# Altium project UniversalConverter.PrjPcb (part 1 of 2)
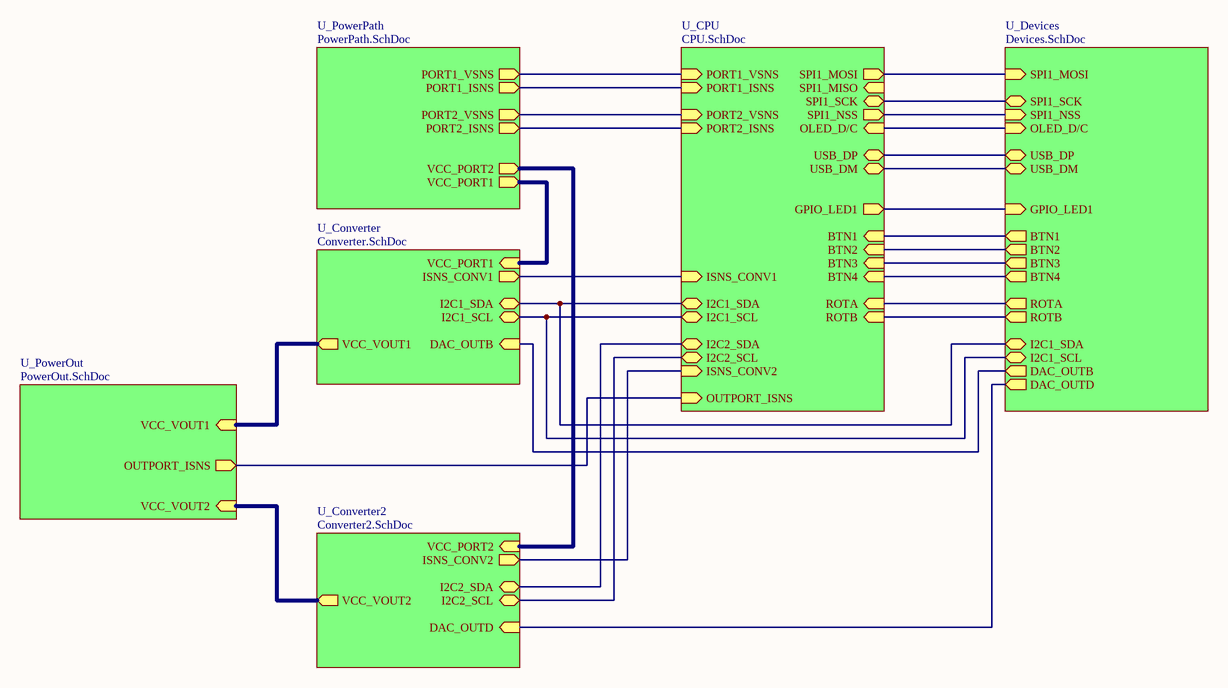
[diagram p0: TopLevel.SchDoc]
7 sheets, 242 parts. Net scope: hierarchical (ports join the sheet entries above them; power ports are global).
Board file: Board.PcbDoc
Sheets:
  TopLevel.SchDoc
    U_Converter = Converter.SchDoc
    U_Devices = Devices.SchDoc
    U_PowerPath = PowerPath.SchDoc
    U_CPU = CPU.SchDoc
    U_PowerOut = PowerOut.SchDoc
    U_Converter2 = Converter2.SchDoc

## Sheet TopLevel.SchDoc
size Tabloid

### Sub-sheets
U_Converter = Converter.SchDoc: DAC_OUTB (in), I2C1_SDA (bidir), I2C1_SCL (bidir), ISNS_CONV1 (out), VCC_PORT1 (in), VCC_VOUT1 (out)
U_Converter2 = Converter2.SchDoc: DAC_OUTD (in), I2C2_SDA (bidir), I2C2_SCL (bidir), ISNS_CONV2 (out), VCC_PORT2 (in), VCC_VOUT2 (out)
U_CPU = CPU.SchDoc: PORT1_ISNS (in), PORT1_VSNS (in), ISNS_CONV1 (in), SPI1_NSS (out), SPI1_SCK (bidir), SPI1_MISO (in), SPI1_MOSI (out), PORT2_ISNS (in), I2C2_SDA (bidir), I2C2_SCL (bidir), BTN1 (in), BTN2 (in), BTN3 (in), BTN4 (in), GPIO_LED1 (out), USB_DM (bidir), USB_DP (bidir), I2C1_SDA (bidir), I2C1_SCL (bidir), PORT2_VSNS (in), ISNS_CONV2 (in), ROTA (in), ROTB (in), OUTPORT_ISNS (in), OLED_D/C (in)
U_Devices = Devices.SchDoc: DAC_OUTB (out), DAC_OUTD (out), GPIO_LED1 (in), BTN1 (out), BTN2 (out), BTN3 (out), BTN4 (out), USB_DM (bidir), USB_DP (bidir), SPI1_NSS (in), SPI1_SCK (bidir), SPI1_MOSI (in), I2C1_SDA (bidir), I2C1_SCL (bidir), ROTA (out), ROTB (out), OLED_D/C (in)
U_PowerOut = PowerOut.SchDoc: VCC_VOUT1 (in), VCC_VOUT2 (in), OUTPORT_ISNS (out)
U_PowerPath = PowerPath.SchDoc: PORT1_VSNS (out), PORT2_VSNS (out), PORT2_ISNS (out), PORT1_ISNS (out), VCC_PORT1 (out), VCC_PORT2 (out)

### Nets
VCC_PORT1: sheet U_Converter/VCC_PORT1, sheet U_PowerPath/VCC_PORT1
VCC_PORT2: sheet U_PowerPath/VCC_PORT2, sheet U_Converter2/VCC_PORT2
VCC_VOUT1: sheet U_Converter/VCC_VOUT1, sheet U_PowerOut/VCC_VOUT1
VCC_VOUT2: sheet U_PowerOut/VCC_VOUT2, sheet U_Converter2/VCC_VOUT2
BTN1: sheet U_Devices/BTN1, sheet U_CPU/BTN1
BTN2: sheet U_Devices/BTN2, sheet U_CPU/BTN2
BTN3: sheet U_Devices/BTN3, sheet U_CPU/BTN3
BTN4: sheet U_Devices/BTN4, sheet U_CPU/BTN4
DAC_OUTB: sheet U_Converter/DAC_OUTB, sheet U_Devices/DAC_OUTB
DAC_OUTD: sheet U_Devices/DAC_OUTD, sheet U_Converter2/DAC_OUTD
GPIO_LED1: sheet U_Devices/GPIO_LED1, sheet U_CPU/GPIO_LED1
I2C1_SCL: sheet U_Converter/I2C1_SCL, sheet U_Devices/I2C1_SCL, sheet U_CPU/I2C1_SCL
I2C1_SDA: sheet U_Converter/I2C1_SDA, sheet U_Devices/I2C1_SDA, sheet U_CPU/I2C1_SDA
I2C2_SCL: sheet U_CPU/I2C2_SCL, sheet U_Converter2/I2C2_SCL
I2C2_SDA: sheet U_CPU/I2C2_SDA, sheet U_Converter2/I2C2_SDA
ISNS_CONV1: sheet U_Converter/ISNS_CONV1, sheet U_CPU/ISNS_CONV1
ISNS_CONV2: sheet U_CPU/ISNS_CONV2, sheet U_Converter2/ISNS_CONV2
OUTPORT_ISNS: sheet U_CPU/OUTPORT_ISNS, sheet U_PowerOut/OUTPORT_ISNS
PORT1_ISNS: sheet U_PowerPath/PORT1_ISNS, sheet U_CPU/PORT1_ISNS
PORT1_VSNS: sheet U_PowerPath/PORT1_VSNS, sheet U_CPU/PORT1_VSNS
PORT2_ISNS: sheet U_PowerPath/PORT2_ISNS, sheet U_CPU/PORT2_ISNS
PORT2_VSNS: sheet U_PowerPath/PORT2_VSNS, sheet U_CPU/PORT2_VSNS
SPI1_MOSI: sheet U_Devices/SPI1_MOSI, sheet U_CPU/SPI1_MOSI
SPI1_NSS: sheet U_Devices/SPI1_NSS, sheet U_CPU/SPI1_NSS
SPI1_SCK: sheet U_Devices/SPI1_SCK, sheet U_CPU/SPI1_SCK
USB_DM: sheet U_Devices/USB_DM, sheet U_CPU/USB_DM
USB_DP: sheet U_Devices/USB_DP, sheet U_CPU/USB_DP
NetR40_1: sheet U_Devices/ROTA, sheet U_CPU/ROTA
NetR43_1: sheet U_Devices/ROTB, sheet U_CPU/ROTB
NetU9_41: sheet U_Devices/OLED_D/C, sheet U_CPU/OLED_D/C

## Sheet Converter.SchDoc
size Tabloid
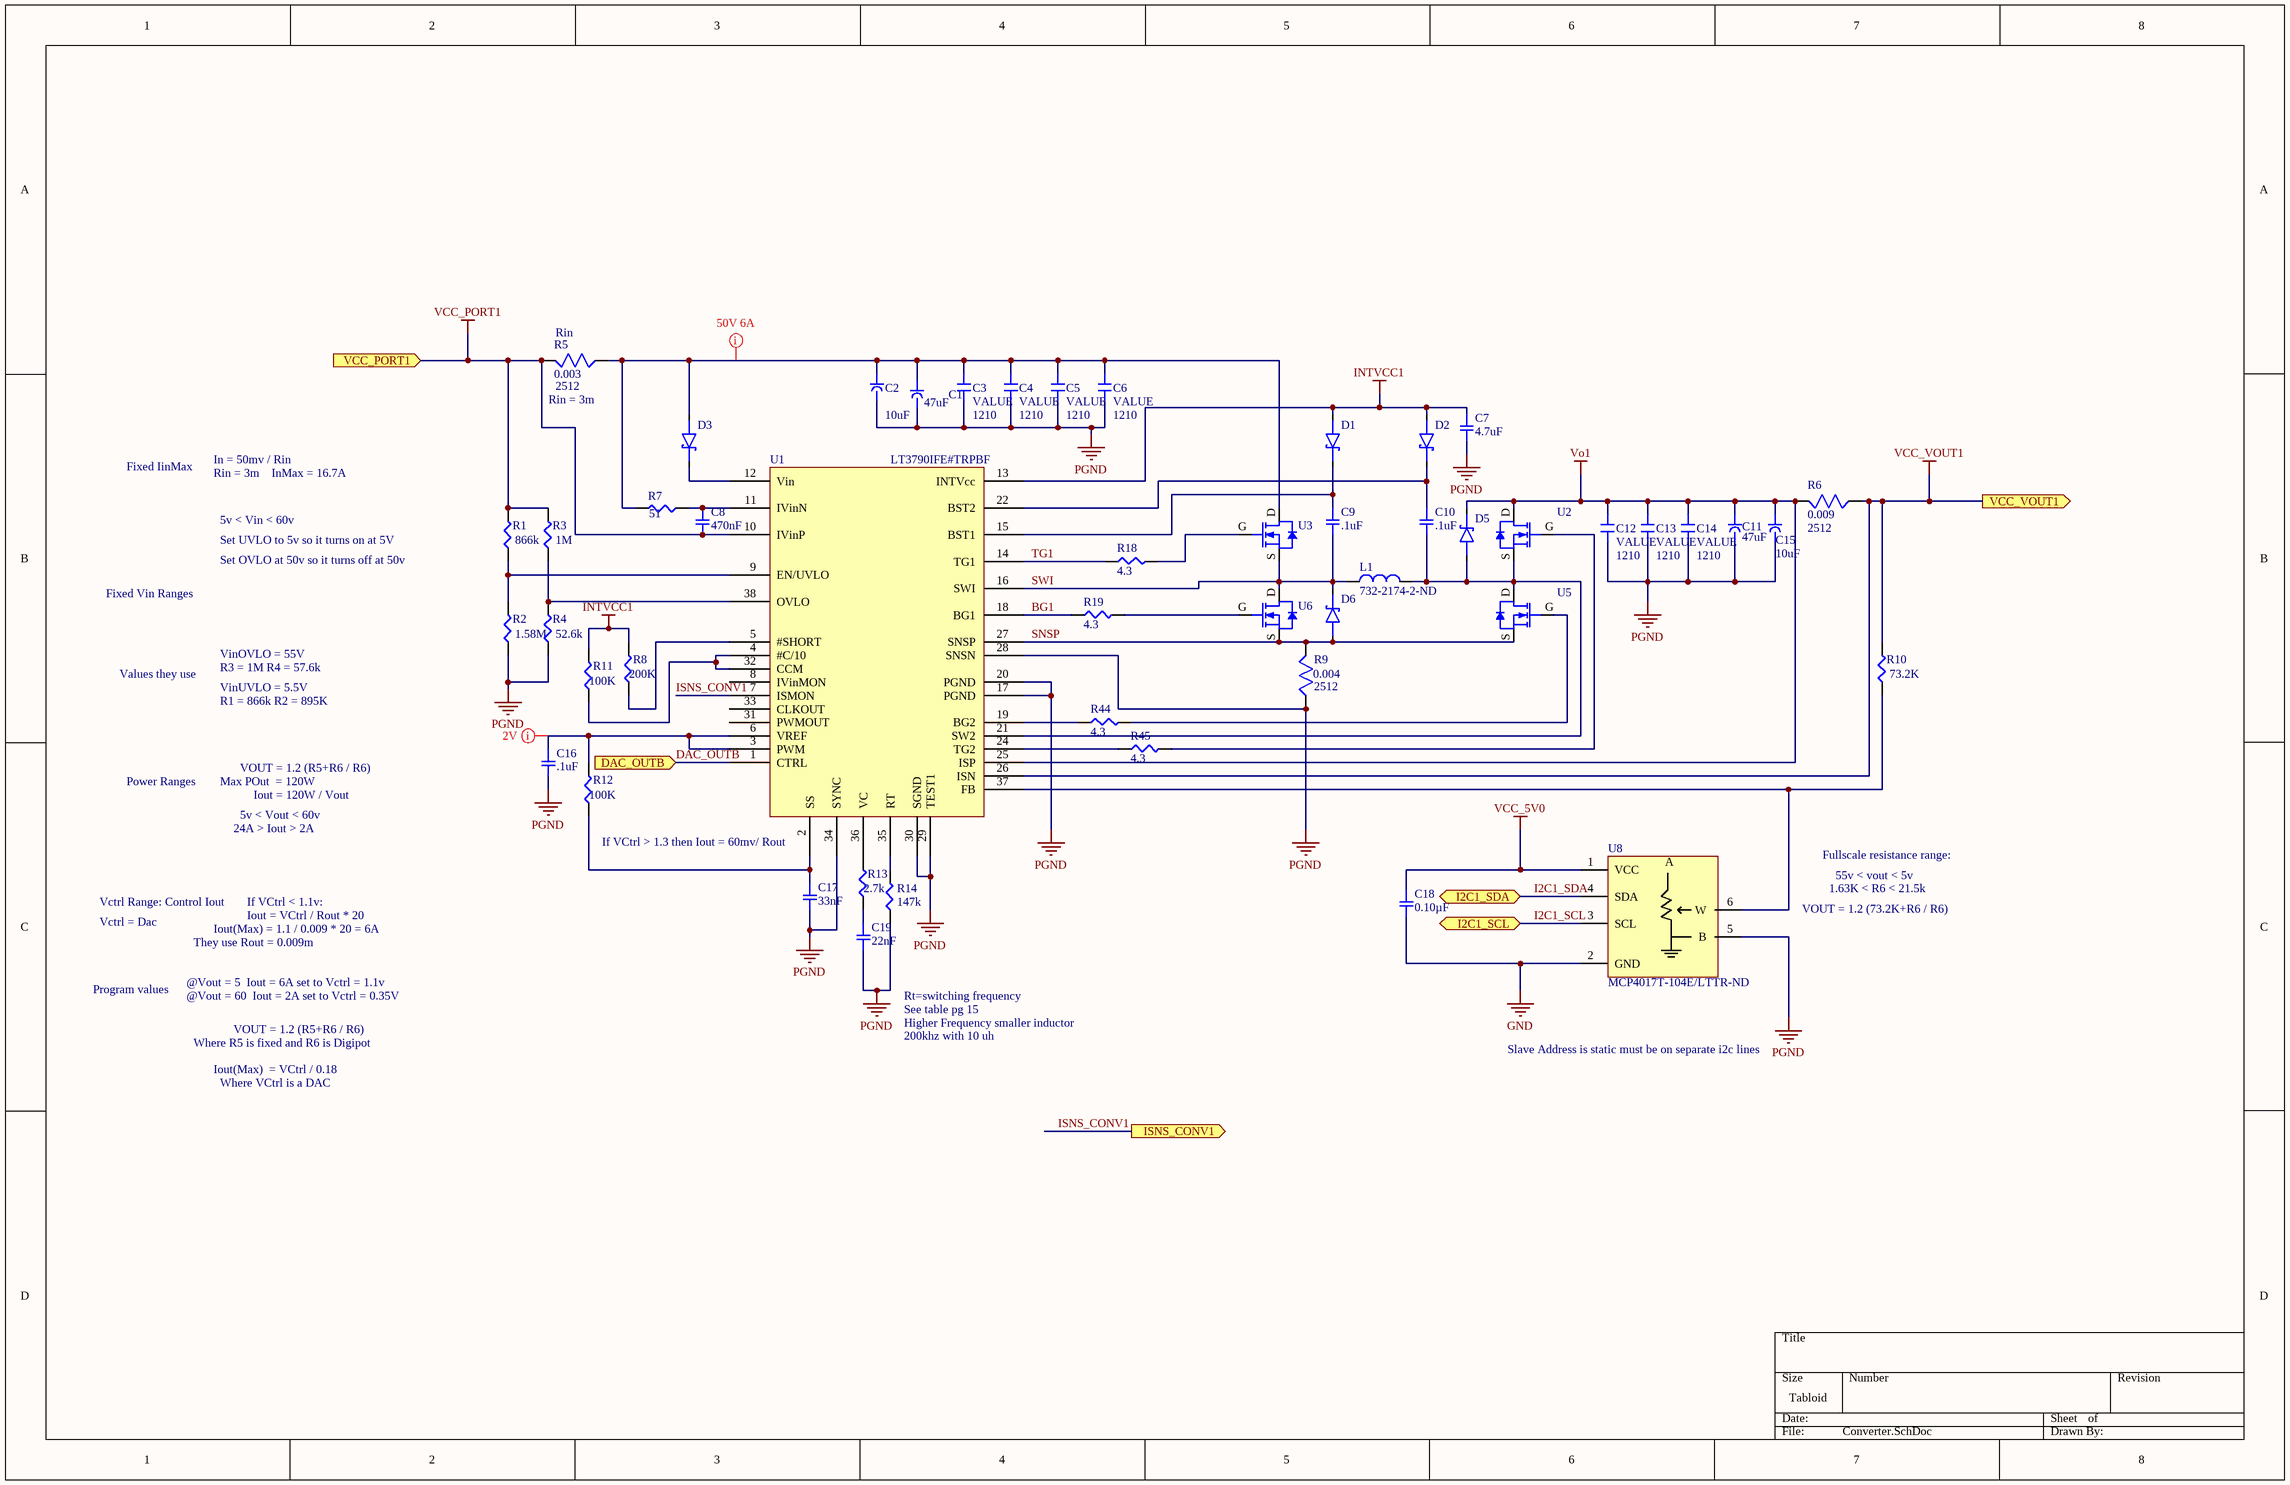
[diagram p1: Converter.SchDoc]

### Parts
C1  10-EEE-FN1K470UVTR-ND  [EEE-FN1K470UV]  (value not drawn)
C2  value 10uF  [panasonic d8]  (hidden comment: EEE-FN1K100XL)
C3  VALUE  Size: 1210  [1210 cap]
C4  VALUE  Size: 1210  [1210 cap]
C5  VALUE  Size: 1210  [1210 cap]
C6  VALUE  Size: 1210  [1210 cap]
C7  4.7uF  [SMD-0603C]
C8  470nF  [SMD-0603C]
C9  .1uF  [SMD-0603C]
C10  .1uF  [SMD-0603C]
C11  10-EEE-FN1K470UVTR-ND  [EEE-FN1K470UV]  (value not drawn)
C12  VALUE  Size: 1210  [1210 cap]
C13  VALUE  Size: 1210  [1210 cap]
C14  VALUE  Size: 1210  [1210 cap]
C15  value 10uF  [panasonic d8]  (hidden comment: EEE-FN1K100XL)
C16  .1uF  [SMD-0603C]
C17  33nF  [SMD-0603C]
C18  0.10µF  [SMD-0603C]
C19  22nF  [SMD-0603C]
D1  BAT46WJ,115  [SOD323F]  (value not drawn)
D2  BAT46WJ,115  [SOD323F]  (value not drawn)
D3  SK58L-TPMSTR-ND  [SMC(DO-214AB)]  (value not drawn)
D5  SK58L-TPMSTR-ND  [SMC(DO-214AB)]  (value not drawn)
D6  SK58L-TPMSTR-ND  [SMC(DO-214AB)]  (value not drawn)
L1  732-2174-2-ND  [Inductor]
R1  866k  [SMD-0603-RES]
R2  1.58M  [SMD-0603-RES]
R3  1M  [SMD-0603-RES]
R4  52.6k  [SMD-0603-RES]
R5  0.003  [2512]
R6  0.009  [2512]
R7  51  [SMD-0603-RES]
R8  200K  [SMD-0603-RES]
R9  0.004  [2512]
R10  73.2K  [SMD-0603-RES]
R11  100K  [SMD-0603-RES]
R12  100K  [SMD-0603-RES]
R13  2.7k  [SMD-0603-RES]
R14  147k  [SMD-0603-RES]
R18  4.3  [SMD-0603-RES]
R19  4.3  [SMD-0603-RES]
R44  4.3  [SMD-0603-RES]
R45  4.3  [SMD-0603-RES]
U1  LT3790IFE#TRPBF  [TSSOP-38-GNDPAD]
U2  SQJA80EP-T1_GE3TR-ND  [PowerPAK® SO-8L SINGLE]  (value not drawn)
U3  SQJA80EP-T1_GE3TR-ND  [PowerPAK® SO-8L SINGLE]  (value not drawn)
U5  SQJA80EP-T1_GE3TR-ND  [PowerPAK® SO-8L SINGLE]  (value not drawn)
U6  SQJA80EP-T1_GE3TR-ND  [PowerPAK® SO-8L SINGLE]  (value not drawn)
U8  MCP4017T-104E/LTTR-ND  [SC70]

### Ports
DAC_OUTB (in), I2C1_SCL (bidir), I2C1_SDA (bidir), ISNS_CONV1 (out), VCC_PORT1 (in), VCC_VOUT1 (out)

### Nets
GND: C18.2 U8.2(GND)
INTVCC1: C7.1 D1.2 D2.2 R8.2 R11.2 U1.13(INTVcc)
PGND: C1.1 C2.2 C3.2 C4.2 C5.2 C6.2 C7.2 C11.1 C12.2 C13.2 C14.2 C15.2 C16.2 C17.2 C19.2 R2.1 R4.1 R9.1 R14.1 U1.17(PGND) U1.20(PGND) U1.28(SNSN) U1.29(TEST1) U1.30(SGND) U1.34(SYNC) U8.5(B)
VCC_5V0: C18.1 U8.1(VCC)
VCC_PORT1: C8.2 R1.2 R3.2 R5.2 U1.10(IVinP) ; port VCC_PORT1
VCC_VOUT1: R6.1 R10.2 U1.26(ISN) ; port VCC_VOUT1
Vo1: C11.2 C12.1 C13.1 C14.1 C15.1 D5.1 R6.2 U1.25(ISP) U2.D(DRAIN)
BG1: R19.1 U1.18(BG1)
DAC_OUTB: U1.1(CTRL) ; port DAC_OUTB
I2C1_SCL: U8.3(SCL) ; port I2C1_SCL
I2C1_SDA: U8.4(SDA) ; port I2C1_SDA
ISNS_CONV1: U1.7(ISMON) ; port ISNS_CONV1
SNSP: D6.2 R9.2 U1.27(SNSP) U5.S(SOURCE) U6.S(SOURCE)
SWI: C9.2 D6.1 L1.1 U1.16(SWI) U3.S(SOURCE) U6.D(DRAIN)
TG1: R18.1 U1.14(TG1)
NetC1_2: C1.2 C2.1 C3.1 C4.1 C5.1 C6.1 D3.2 R5.1 R7.2 U3.D(DRAIN)
NetC8_1: C8.1 R7.1 U1.11(IVinN)
NetC9_1: C9.1 D1.1 U1.15(BST1)
NetC10_1: C10.1 D2.1 U1.22(BST2)
NetC10_2: C10.2 D5.2 L1.2 U1.21(SW2) U2.S(SOURCE) U5.D(DRAIN)
NetC16_1: C16.1 R12.2 U1.3(PWM) U1.6(VREF)
NetC17_1: C17.1 R12.1 U1.2(SS)
NetC19_1: C19.1 R13.1
NetD3_1: D3.1 U1.12(Vin)
NetR1_1: R1.1 R2.2 U1.9(EN/UVLO)
NetR3_1: R3.1 R4.2 U1.38(OVLO)
NetR8_1: R8.1 U1.5(#SHORT)
NetR10_1: R10.1 U1.37(FB) U8.6(W)
NetR11_1: R11.1 U1.4(#C/10) U1.32(CCM)
NetR13_2: R13.2 U1.36(VC)
NetR14_2: R14.2 U1.35(RT)
NetR18_2: R18.2 U3.G(GATE)
NetR19_2: R19.2 U6.G(GATE)
NetR44_1: R44.1 U1.19(BG2)
NetR44_2: R44.2 U5.G(GATE)
NetR45_1: R45.1 U1.24(TG2)
NetR45_2: R45.2 U2.G(GATE)

Not connected (* = marked no-connect by the designer): U1 8(IVinMON) 31(PWMOUT) 33(CLKOUT)

### Layout directives
mark named 2V: NetC16_1
mark named 50V 6A: NetC1_2

### Notes on the sheet
- (near R5) Rin
- (near R5) Rin = 3m
- Fixed IinMax
- Rin = 3m    InMax = 16.7A
- In = 50mv / Rin
- Set UVLO to 5v so it turns on at 5V
- Set OVLO at 50v so it turns off at 50v
- 5v < Vin < 60v
- Fixed Vin Ranges
- Values they use
- VinOVLO = 55V
- R3 = 1M R4 = 57.6k
- VinUVLO = 5.5V
- R1 = 866k R2 = 895K
- Power Ranges
- Max POut  = 120W
- 24A > Iout > 2A
- 5v < Vout < 60v
- VOUT = 1.2 (R5+R6 / R6)
- Iout = 120W / Vout
- If VCtrl > 1.3 then Iout = 60mv/ Rout
- Fullscale resistance range:
- 1.63K < R6 < 21.5k
- 55v < vout < 5v
- Vctrl Range: Control Iout
- Vctrl = Dac
- They use Rout = 0.009m
- Iout(Max) = 1.1 / 0.009 * 20 = 6A
- If VCtrl < 1.1v:
- Iout = VCtrl / Rout * 20
- VOUT = 1.2 (73.2K+R6 / R6)
- Program values
- @Vout = 5  Iout = 6A set to Vctrl = 1.1v
- @Vout = 60  Iout = 2A set to Vctrl = 0.35V
- Rt=switching frequency
- See table pg 15
- Higher Frequency smaller inductor
- Where R5 is fixed and R6 is Digipot
- Iout(Max)  = VCtrl / 0.18
- Where VCtrl is a DAC
- 200khz with 10 uh
- Slave Address is static must be on separate i2c lines
- (in symbol CAP ALUM 47UF) 47uF
- (in symbol IC DIGIPOT MCP4017T-104E/LT) A

### Library data of the parts
C1 C11 = CAP ALUM 47UF: CAP ALUM 47UF 20% 80V SMD
C2 C15 = CAP ALUM 10UF: CAP ALUM 10UF 20% 80V SMD
C3-C6 C12-C14 = CAP SMD 1210
C7-C10 C16 C17 C19 = GCJ188R71H472KA01D: 0603; Manufacturer: Murata Electronics North America; Factory Stock: 0; Unit Price (USD): 0.19; Minimum Quantity: 1; Value: 4700pF; Tolerance: ±10%; Voltage: 50V; Temperature Coefficient: X7R; Datasheets: http://www.murata.com/~/media/webrenewal/support/library/catalog/products/capacitor/mlcc/c03e.ashx; Image: //media.digikey.com/Renders/Murata%20Renders/0603%28LQG18%29.jpg; Digi-Key Part Number: 490-5764-1-ND; Part Number: GCJ188R71H472KA01D; Quantity Available: 7743; @ qty: 0; Packaging: Cut Tape (CT); Series: GCJ; Part Status: Active; Operating Temperature: -55°C ~ 125°C; Features: Soft Termination; Ratings: AEC-Q200; Applications: Automotive, Boardflex Sensitive; Mounting Type: Surface Mount, MLCC; Package / Case: 0603 (1608 Metric); Size / Dimension: 0.063" L x 0.031" W (1.60mm x 0.80mm); Height - Seated (Max): -; Thickness (Max): 0.031" (0.80mm); Lead Spacing: -; Lead Style: -
C18 = GCJ188R71H104KA12D: CAP CER 0.1UF 50V X7R 0603; Manufacturer: Murata Electronics North America; Factory Stock: 0; Unit Price (USD): 0.12; Minimum Quantity: 1; Tolerance: ±10%; Datasheets: http://www.murata.com/~/media/webrenewal/support/library/catalog/products/capacitor/mlcc/c03e.ashx; Image: //media.digikey.com/Renders/Murata%20Renders/0603%28LQG18%29.jpg; Digi-Key Part Number: 490-5798-1-ND; Part Number: GCJ188R71H104KA12D; Quantity Available: 163695; @ qty: 0; Packaging: Cut Tape (CT); Series: GCJ; Part Status: Active; Value: 0.10µF; Voltage: 50V; Temperature Coefficient: X7R; Operating Temperature: -55°C ~ 125°C; Features: Soft Termination; Ratings: AEC-Q200; Applications: Automotive, Boardflex Sensitive; Mounting Type: Surface Mount, MLCC; Package / Case: 0603 (1608 Metric); Size / Dimension: 0.063" L x 0.031" W (1.60mm x 0.80mm); Height - Seated (Max): -; Thickness (Max): 0.035" (0.90mm); Lead Spacing: -; Lead Style: -
D1 D2 = BAT46WJ,115: DIODE SCHOTTKY 100V 250MA SOD323 / Diode Schottky 100 V 250mA (DC) Surface Mount SOD-323F; Mfr_Name: Nexperia; Type: DEV; Copyright: Copyright (C) 2021 Ultra Librarian. All rights reserved.; Manufacturer_Part_Number: BAT46WJ,115; Digi-Key_Part_Number_1: 1727-4817-2-ND; Digi-Key_Part_Number_2: 1727-4817-1-ND; Digi-Key_Part_Number_3: 1727-4817-6-ND; RefDes: RefDes
D3 D5 D6 = DIODE SK58L-TP: DIODE SCHOTTKY 80V 5A DO214AB/SMC / Diode Schottky 80 V 5A Surface Mount SMC (DO-214AB)
L1 = INDUCTOR 7443556680: FIXED IND 6.8UH 18.5A 4.1MOHM SM
R1-R4 R7 R8 R10-R14 = ERJ-3BQJ5R6V: 0603; Manufacturer: Panasonic Electronic Components; Factory Stock: 0; Unit Price (USD): 0.03980; @ qty: 1500; Minimum Quantity: 1; Value: 5.6; Tolerance: ±5%; Power (Watts): 0.25W, 1/4W; Temperature Coefficient: ±200ppm/°C; Part Number: ERJ-3BQJ5R6V; Datasheets: https://industrial.panasonic.com/cdbs/www-data/pdf/RDA0000/AOA0000C239.pdf; Image: //media.digikey.com/Photos/Panasonic%20Photos/MFG_ERJ-P6W%20Series.jpg; Digi-Key Part Number: P17425CT-ND; Quantity Available: 3950; Packaging: Cut Tape (CT); Series: ERJ; Part Status: Active; Composition: Thick Film; Features: Automotive AEC-Q200, Current Sense; Operating Temperature: -55°C ~ 125°C; Package / Case: 0603 (1608 Metric); Supplier Device Package: 0603; Size / Dimension: 0.063" L x 0.031" W (1.60mm x 0.80mm); Height - Seated (Max): 0.022" (0.55mm); Number of Terminations: 2; Failure Rate: -
R5 R6 R9 = RES SMD 2512: RES SMD 2512 2W; Size: 2512
R18 R19 R44 R45 = ERJ-3BQF1R0V: RES SMD 1 OHM 1% 1/4W 0603; Manufacturer: Panasonic Electronic Components; Factory Stock: 0; Unit Price (USD): 0.05386; @ qty: 1500; Minimum Quantity: 1; Value: 1; Power (Watts): 0.25W, 1/4W; Temperature Coefficient: ±200ppm/°C; Part Number: ERJ-3BQF1R0V; Datasheets: https://industrial.panasonic.com/cdbs/www-data/pdf/RDA0000/AOA0000C239.pdf; Image: //media.digikey.com/Photos/Panasonic%20Photos/MFG_ERJ-P6W%20Series.jpg; Digi-Key Part Number: P17371CT-ND; Quantity Available: 30514; Packaging: Cut Tape (CT); Series: ERJ; Part Status: Active; Tolerance: ±1%; Composition: Thick Film; Features: Automotive AEC-Q200, Current Sense; Operating Temperature: -55°C ~ 125°C; Package / Case: 0603 (1608 Metric); Supplier Device Package: 0603; Size / Dimension: 0.063" L x 0.031" W (1.60mm x 0.80mm); Height - Seated (Max): 0.022" (0.55mm); Number of Terminations: 2; Failure Rate: -
U1 = IC LT3790 BUCK/BOOST 60V 150W: IC REG CTRLR BUCK-BOOST 38TSSOP / Buck-Boost Regulator Positive Output Step-Up/Step-Down - DC-DC Controller IC 38-TSSOP-EP
U2 U3 U5 U6 = FET SQJA80EP-T1_GE3: MOSFET N-CH 80V 60A PPAK SO-8
U8 = IC DIGIPOT MCP4017T-104E/LT: IC DGT POT 100KOHM 128TAP SC70-6

## Sheet Devices.SchDoc
size Tabloid
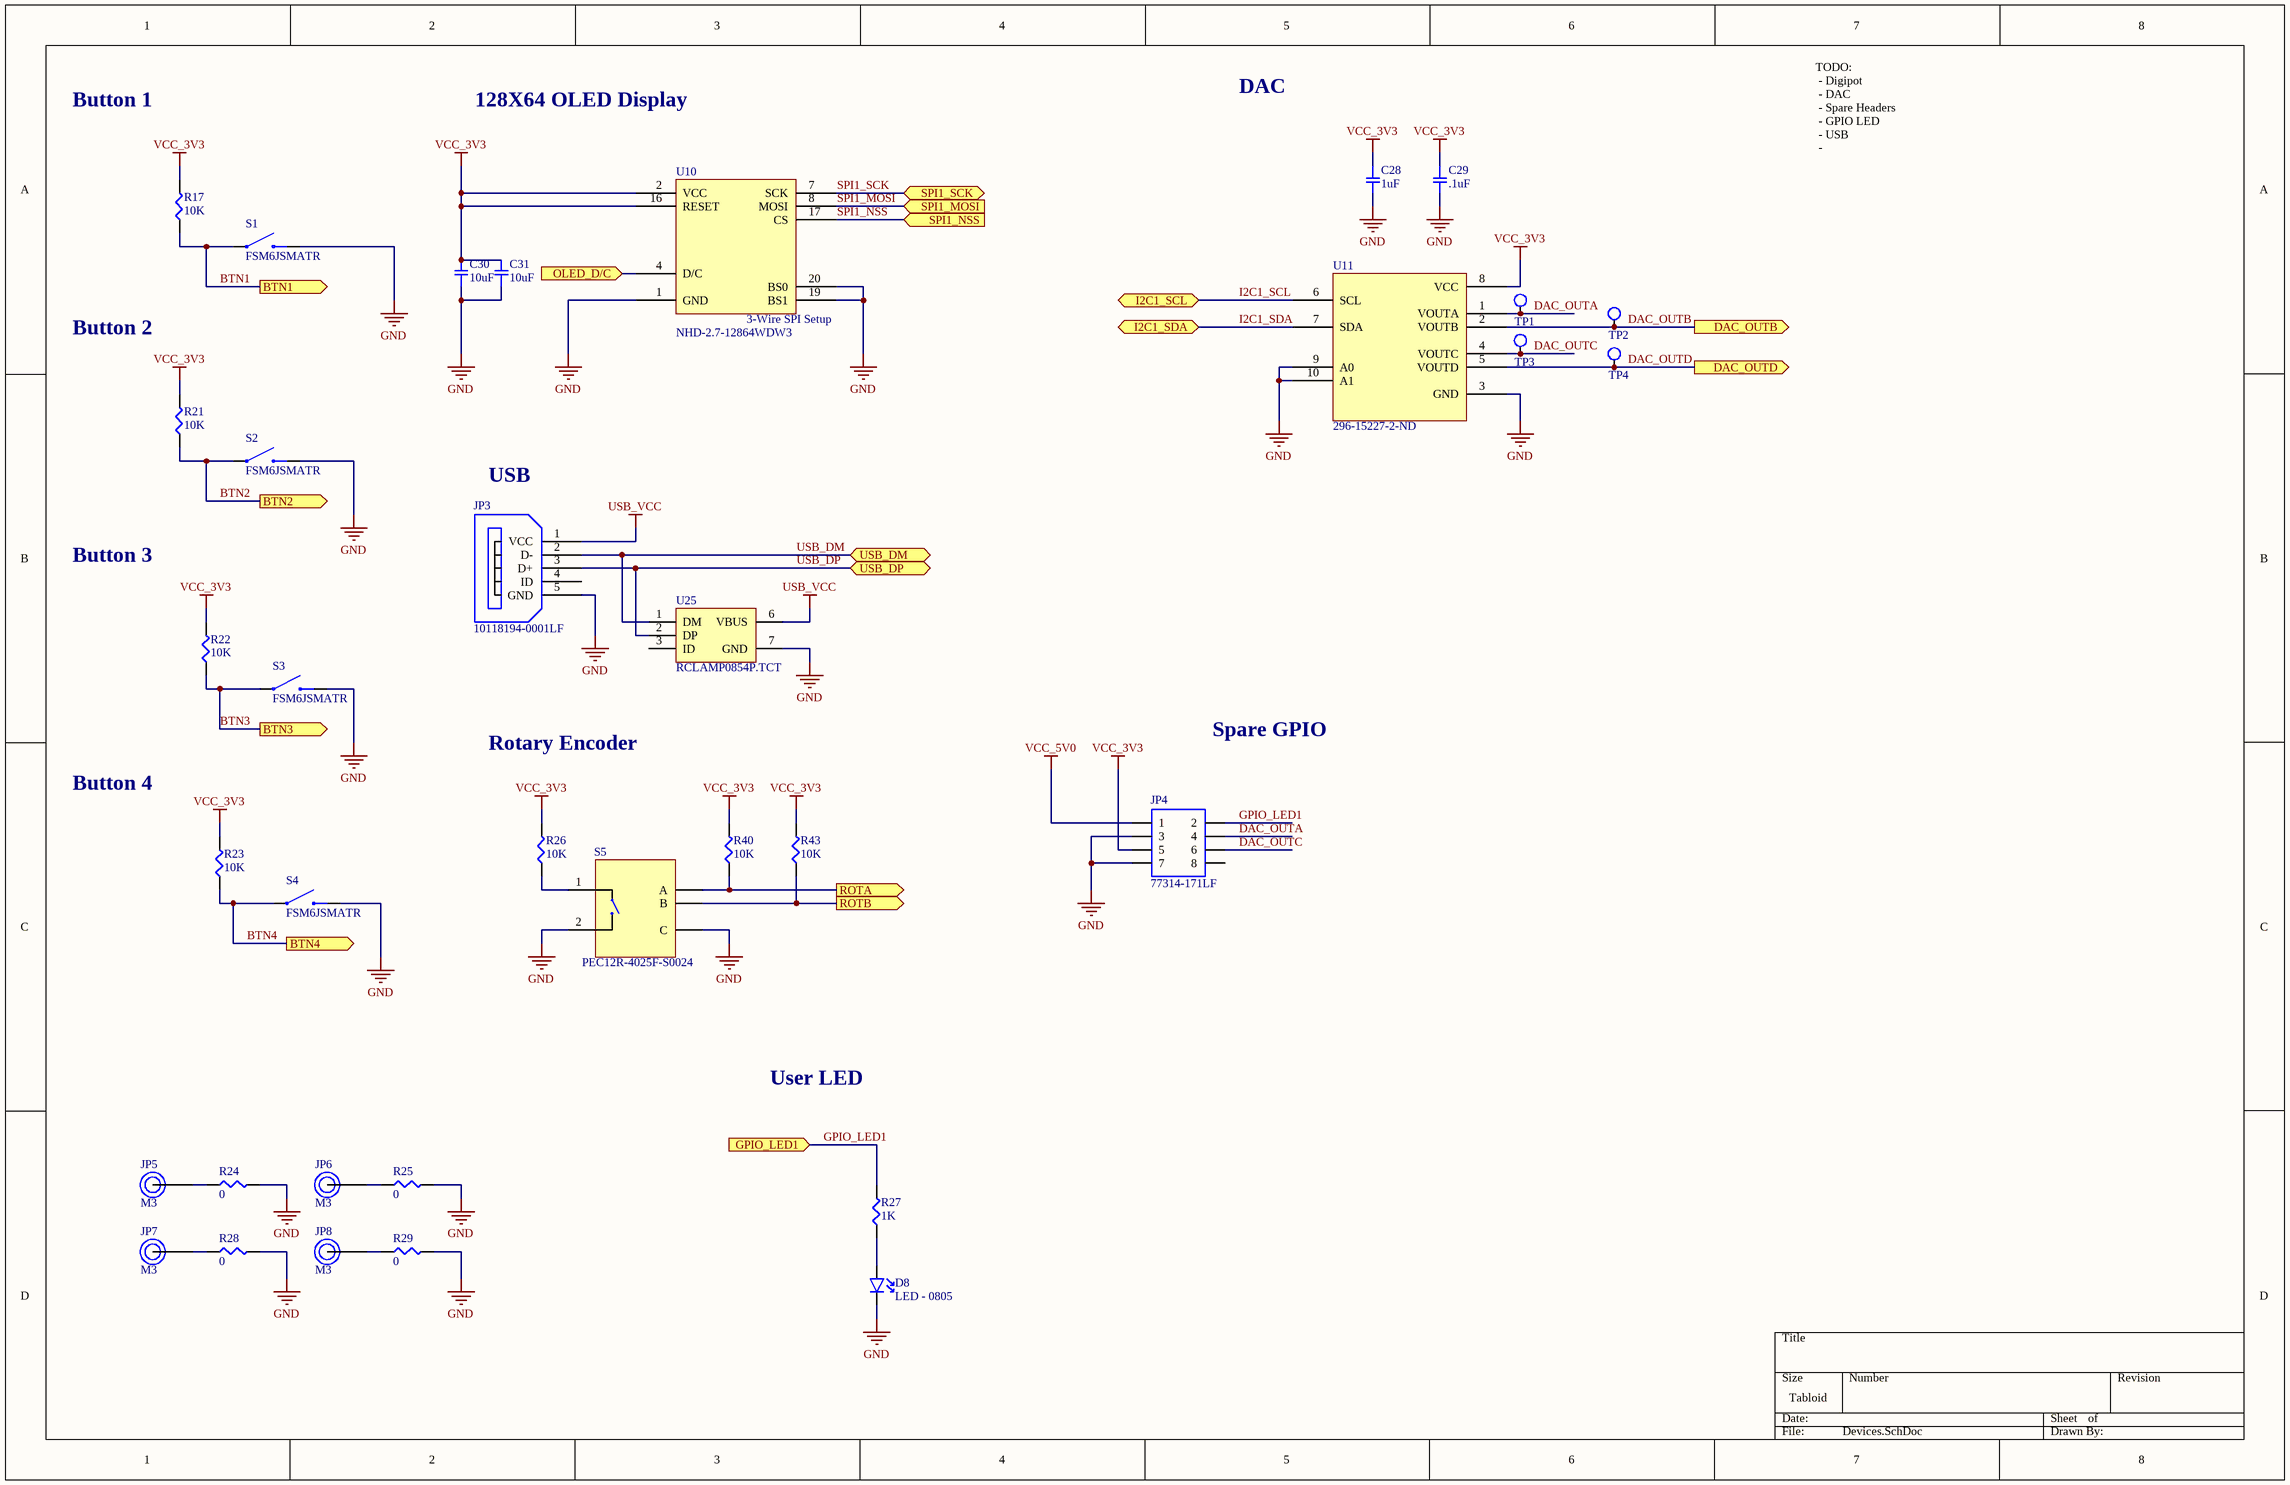
[diagram p2: Devices.SchDoc]

### Parts
C28  1uF  [SMD-0603C]
C29  .1uF  [SMD-0603C]
C30  10uF  [SMD-0805C]
C31  10uF  [SMD-0805C]
D8  LED - 0805  [0805 SMD]
JP3  10118194-0001LF  [014-439]
JP4  77314-171LF  [2x4 Pin Header]
JP5  M3  [M3-Hole]
JP6  M3  [M3-Hole]
JP7  M3  [M3-Hole]
JP8  M3  [M3-Hole]
R17  10K  [SMD-0805-RES]
R21  10K  [SMD-0805-RES]
R22  10K  [SMD-0805-RES]
R23  10K  [SMD-0805-RES]
R24  0  [SMD-0603-RES]
R25  0  [SMD-0603-RES]
R26  10K  [SMD-0805-RES]
R27  1K  [SMD-0603-RES]
R28  0  [SMD-0603-RES]
R29  0  [SMD-0603-RES]
R40  10K  [SMD-0805-RES]
R43  10K  [SMD-0805-RES]
S1  FSM6JSMATR  [TACTILE 4 PIN SMD 6MM]
S2  FSM6JSMATR  [TACTILE 4 PIN SMD 6MM]
S3  FSM6JSMATR  [TACTILE 4 PIN SMD 6MM]
S4  FSM6JSMATR  [TACTILE 4 PIN SMD 6MM]
S5  PEC12R-4025F-S0024  [PEC12R-4025F-S]
TP1  TEST POINT 1MM  [TEST POINT]  (value not drawn)
TP2  TEST POINT 1MM  [TEST POINT]  (value not drawn)
TP3  TEST POINT 1MM  [TEST POINT]  (value not drawn)
TP4  TEST POINT 1MM  [TEST POINT]  (value not drawn)
U10  NHD-2.7-12864WDW3  [NHD-2.7-12864WDW3]
U11  296-15227-2-ND  [10-VSSOP]
U25  RCLAMP0854P.TCT  [6-UFDFN]

### Ports
BTN1 (out), BTN2 (out), BTN3 (out), BTN4 (out), DAC_OUTB (out), DAC_OUTD (out), GPIO_LED1 (in), I2C1_SCL (bidir), I2C1_SDA (bidir), OLED_D/C (in), ROTA (out), ROTB (out), SPI1_MOSI (in), SPI1_NSS (in), SPI1_SCK (bidir), USB_DM (bidir), USB_DP (bidir)

### Nets
GND: C28.2 C29.2 C30.1 C31.1 D8.2 JP3.5(GND) JP4.3 JP4.7 R24.2 R25.2 R28.2 R29.2 S1.2 S2.2 S3.2 S4.2 S5.2 S5.C U10.1(GND) U10.19(BS1) U10.20(BS0) U11.3(GND) U11.9(A0) U11.10(A1) U25.7(GND)
USB_VCC: JP3.1(VCC) U25.6(VBUS)
VCC_3V3: C28.1 C29.1 C30.2 C31.2 JP4.5 R17.2 R21.2 R22.2 R23.2 R26.2 R40.2 R43.2 U10.2(VCC) U10.16(RESET) U11.8(VCC)
VCC_5V0: JP4.1
BTN1: R17.1 S1.1 ; port BTN1
BTN2: R21.1 S2.1 ; port BTN2
BTN3: R22.1 S3.1 ; port BTN3
BTN4: R23.1 S4.1 ; port BTN4
DAC_OUTA: JP4.4 TP1.1 U11.1(VOUTA)
DAC_OUTB: TP2.1 U11.2(VOUTB) ; port DAC_OUTB
DAC_OUTC: JP4.6 TP3.1 U11.4(VOUTC)
DAC_OUTD: TP4.1 U11.5(VOUTD) ; port DAC_OUTD
GPIO_LED1: JP4.2 R27.2 ; port GPIO_LED1
I2C1_SCL: U11.6(SCL) ; port I2C1_SCL
I2C1_SDA: U11.7(SDA) ; port I2C1_SDA
SPI1_MOSI: U10.8(MOSI) ; port SPI1_MOSI
SPI1_NSS: U10.17(CS) ; port SPI1_NSS
SPI1_SCK: U10.7(SCK) ; port SPI1_SCK
USB_DM: JP3.2(D-) U25.1(DM) ; port USB_DM
USB_DP: JP3.3(D+) U25.2(DP) ; port USB_DP
NetD8_1: D8.1 R27.1
NetJP5_1: JP5.1 R24.1
NetJP6_1: JP6.1 R25.1
NetJP7_1: JP7.1 R28.1
NetJP8_1: JP8.1 R29.1
NetR26_1: R26.1 S5.1
NetR40_1: R40.1 S5.A ; port ROTA
NetR43_1: R43.1 S5.B ; port ROTB
NetU9_41: U10.4(D/C) ; port OLED_D/C

Not connected (* = marked no-connect by the designer): JP3 4(ID); JP4 8; U25 3(ID)

### Notes on the sheet
- DAC
- Button 1
- 128X64 OLED Display
- TODO:
  - Digipot
  - DAC
  - Spare Headers
  - GPIO LED
  - USB
  -
- Button 2
- USB
- Button 3
- Rotary Encoder
- Spare GPIO
- Button 4
- User LED
- (in symbol DISP OLED GRAPHIC 128X64 WHT) 3-Wire SPI Setup

### Library data of the parts
C28 C29 = GCJ188R71H223KA01D: CAP CER 0.022UF 50V X7R 0603; Manufacturer: Murata Electronics North America; Factory Stock: 0; Unit Price (USD): 0.22; Minimum Quantity: 1; Value: 0.022µF; Tolerance: ±10%; Datasheets: http://www.murata.com/~/media/webrenewal/support/library/catalog/products/capacitor/mlcc/c03e.ashx; Image: //media.digikey.com/Renders/Murata%20Renders/0603%28LQG18%29.jpg; Digi-Key Part Number: 490-5851-1-ND; Part Number: GCJ188R71H223KA01D; Quantity Available: 7651; @ qty: 0; Packaging: Cut Tape (CT); Series: GCJ; Part Status: Active; Voltage: 50V; Temperature Coefficient: X7R; Operating Temperature: -55°C ~ 125°C; Features: Soft Termination; Ratings: AEC-Q200; Applications: Automotive, Boardflex Sensitive; Mounting Type: Surface Mount, MLCC; Package / Case: 0603 (1608 Metric); Size / Dimension: 0.063" L x 0.031" W (1.60mm x 0.80mm); Height - Seated (Max): -; Thickness (Max): 0.031" (0.80mm); Lead Spacing: -; Lead Style: -
C30 C31 = LLA219R71C104MA01L: CAP CER 0.1UF 16V X7R 0805; Manufacturer: Murata Electronics North America; Factory Stock: 0; Unit Price (USD): 0.36; Minimum Quantity: 1; Value: 0.10µF; Tolerance: ±20%; Datasheets: http://www.murata.com/~/media/webrenewal/support/library/catalog/products/capacitor/mlcc/c02e.pdf; Image: //media.digikey.com/Renders/Murata%20Renders/0805-LLA.jpg; Digi-Key Part Number: 490-4414-1-ND; Part Number: LLA219R71C104MA01L; Quantity Available: 7094; @ qty: 0; Packaging: Cut Tape (CT); Series: LLA; Part Status: Active; Voltage: 16V; Temperature Coefficient: X7R; Operating Temperature: -55°C ~ 125°C; Features: Low ESL (Multi-Terminal); Ratings: -; Applications: Bypass, Decoupling; Mounting Type: Surface Mount, MLCC; Package / Case: 0805 (2012 Metric); Size / Dimension: 0.079" L x 0.049" W (2.00mm x 1.25mm); Height - Seated (Max): -; Thickness (Max): 0.037" (0.95mm); Lead Spacing: -; Lead Style: -
JP3 = CONN USB: CONN RCPT USB2.0 MICRO B SMD R/A
JP4 = CONN HEADER VERT 2x4: CONN HEADER VERT 8POS 2.54MM
JP5-JP8 = HOLE MOUNT M3: M3 MOUNT HOLE SIZE
R17 R21-R23 R26 R40 R43 = ERJ-6BWFR100V: RES SMD 0.1 OHM 1% 1/2W 0805; Manufacturer: Panasonic Electronic Components; Factory Stock: 0; Unit Price (USD): 0.15268; @ qty: 1500; Minimum Quantity: 1; Value: 0.1; Power (Watts): 0.5W, 1/2W; Temperature Coefficient: ±200ppm/°C; Part Number: ERJ-6BWFR100V; Datasheets: https://industrial.panasonic.com/cdbs/www-data/pdf/RDA0000/AOA0000C239.pdf; Image: //media.digikey.com/Renders/Panasonic%20Renders/ERJ-0805%20Pkg.jpg; Digi-Key Part Number: P17589CT-ND; Quantity Available: 12233; Packaging: Cut Tape (CT); Series: ERJ; Part Status: Active; Tolerance: ±1%; Composition: Thick Film; Features: Automotive AEC-Q200, Current Sense; Operating Temperature: -55°C ~ 155°C; Package / Case: 0805 (2012 Metric); Supplier Device Package: 0805; Size / Dimension: 0.079" L x 0.049" W (2.00mm x 1.25mm); Height - Seated (Max): 0.030" (0.75mm); Number of Terminations: 2; Failure Rate: -
R24 R25 R28 R29 = ERJ-3BQFR33V: RES SMD 0.33 OHM 1% 1/4W 0603; Manufacturer: Panasonic Electronic Components; Unit Price (USD): 0.05386; @ qty: 1500; Minimum Quantity: 1; Value: 0.33; Power (Watts): 0.25W, 1/4W; Temperature Coefficient: ±300ppm/°C; Part Number: ERJ-3BQFR33V; Datasheets: https://industrial.panasonic.com/cdbs/www-data/pdf/RDA0000/AOA0000C239.pdf; Image: //media.digikey.com/Photos/Panasonic%20Photos/MFG_ERJ-P6W%20Series.jpg; Digi-Key Part Number: P17396CT-ND; Quantity Available: 1368; Factory Stock: 0; Packaging: Cut Tape (CT); Series: ERJ; Part Status: Active; Tolerance: ±1%; Composition: Thick Film; Features: Automotive AEC-Q200, Current Sense; Operating Temperature: -55°C ~ 125°C; Package / Case: 0603 (1608 Metric); Supplier Device Package: 0603; Size / Dimension: 0.063" L x 0.031" W (1.60mm x 0.80mm); Height - Seated (Max): 0.022" (0.55mm); Number of Terminations: 2; Failure Rate: -
R27 = ERJ-3BQF1R5V: RES SMD 1.5 OHM 1% 1/4W 0603; Manufacturer: Panasonic Electronic Components; Factory Stock: 0; Unit Price (USD): 0.06115; @ qty: 1500; Minimum Quantity: 1; Value: 1.5; Power (Watts): 0.25W, 1/4W; Temperature Coefficient: ±200ppm/°C; Part Number: ERJ-3BQF1R5V; Datasheets: https://industrial.panasonic.com/cdbs/www-data/pdf/RDA0000/AOA0000C239.pdf; Image: //media.digikey.com/Photos/Panasonic%20Photos/MFG_ERJ-P6W%20Series.jpg; Digi-Key Part Number: P15988CT-ND; Quantity Available: 1591; Packaging: Cut Tape (CT); Series: ERJ; Part Status: Active; Tolerance: ±1%; Composition: Thick Film; Features: Automotive AEC-Q200, Current Sense; Operating Temperature: -55°C ~ 125°C; Package / Case: 0603 (1608 Metric); Supplier Device Package: 0603; Size / Dimension: 0.063" L x 0.031" W (1.60mm x 0.80mm); Height - Seated (Max): 0.022" (0.55mm); Number of Terminations: 2; Failure Rate: -
S1-S4 = SWITCH TACTILE SPST: SWITCH TACTILE SPST-NO 0.05A 24V
S5 = RTRY ENCDR MECH 24PPR: Rotary Encoder Mechanical 24 Quadrature (Incremental) Vertical
TP1-TP4 = TEST POINT 1MM: 1mm pad for test points
U10 = DISP OLED GRAPHIC 128X64 WHT: Graphic LCD Display Module  White OLED - Passive Matrix Parallel/Serial 2.7" (68.58mm) 128 x 64
U11 = IC DAC DAC7574IDGSR: IC DAC 12BIT V-OUT 10VSSOP
U25 = IC RCLAMP0854P.TCT: TVS DIODE 5.5VWM 30VC SLP1616P6

## Sheet PowerPath.SchDoc
size Tabloid
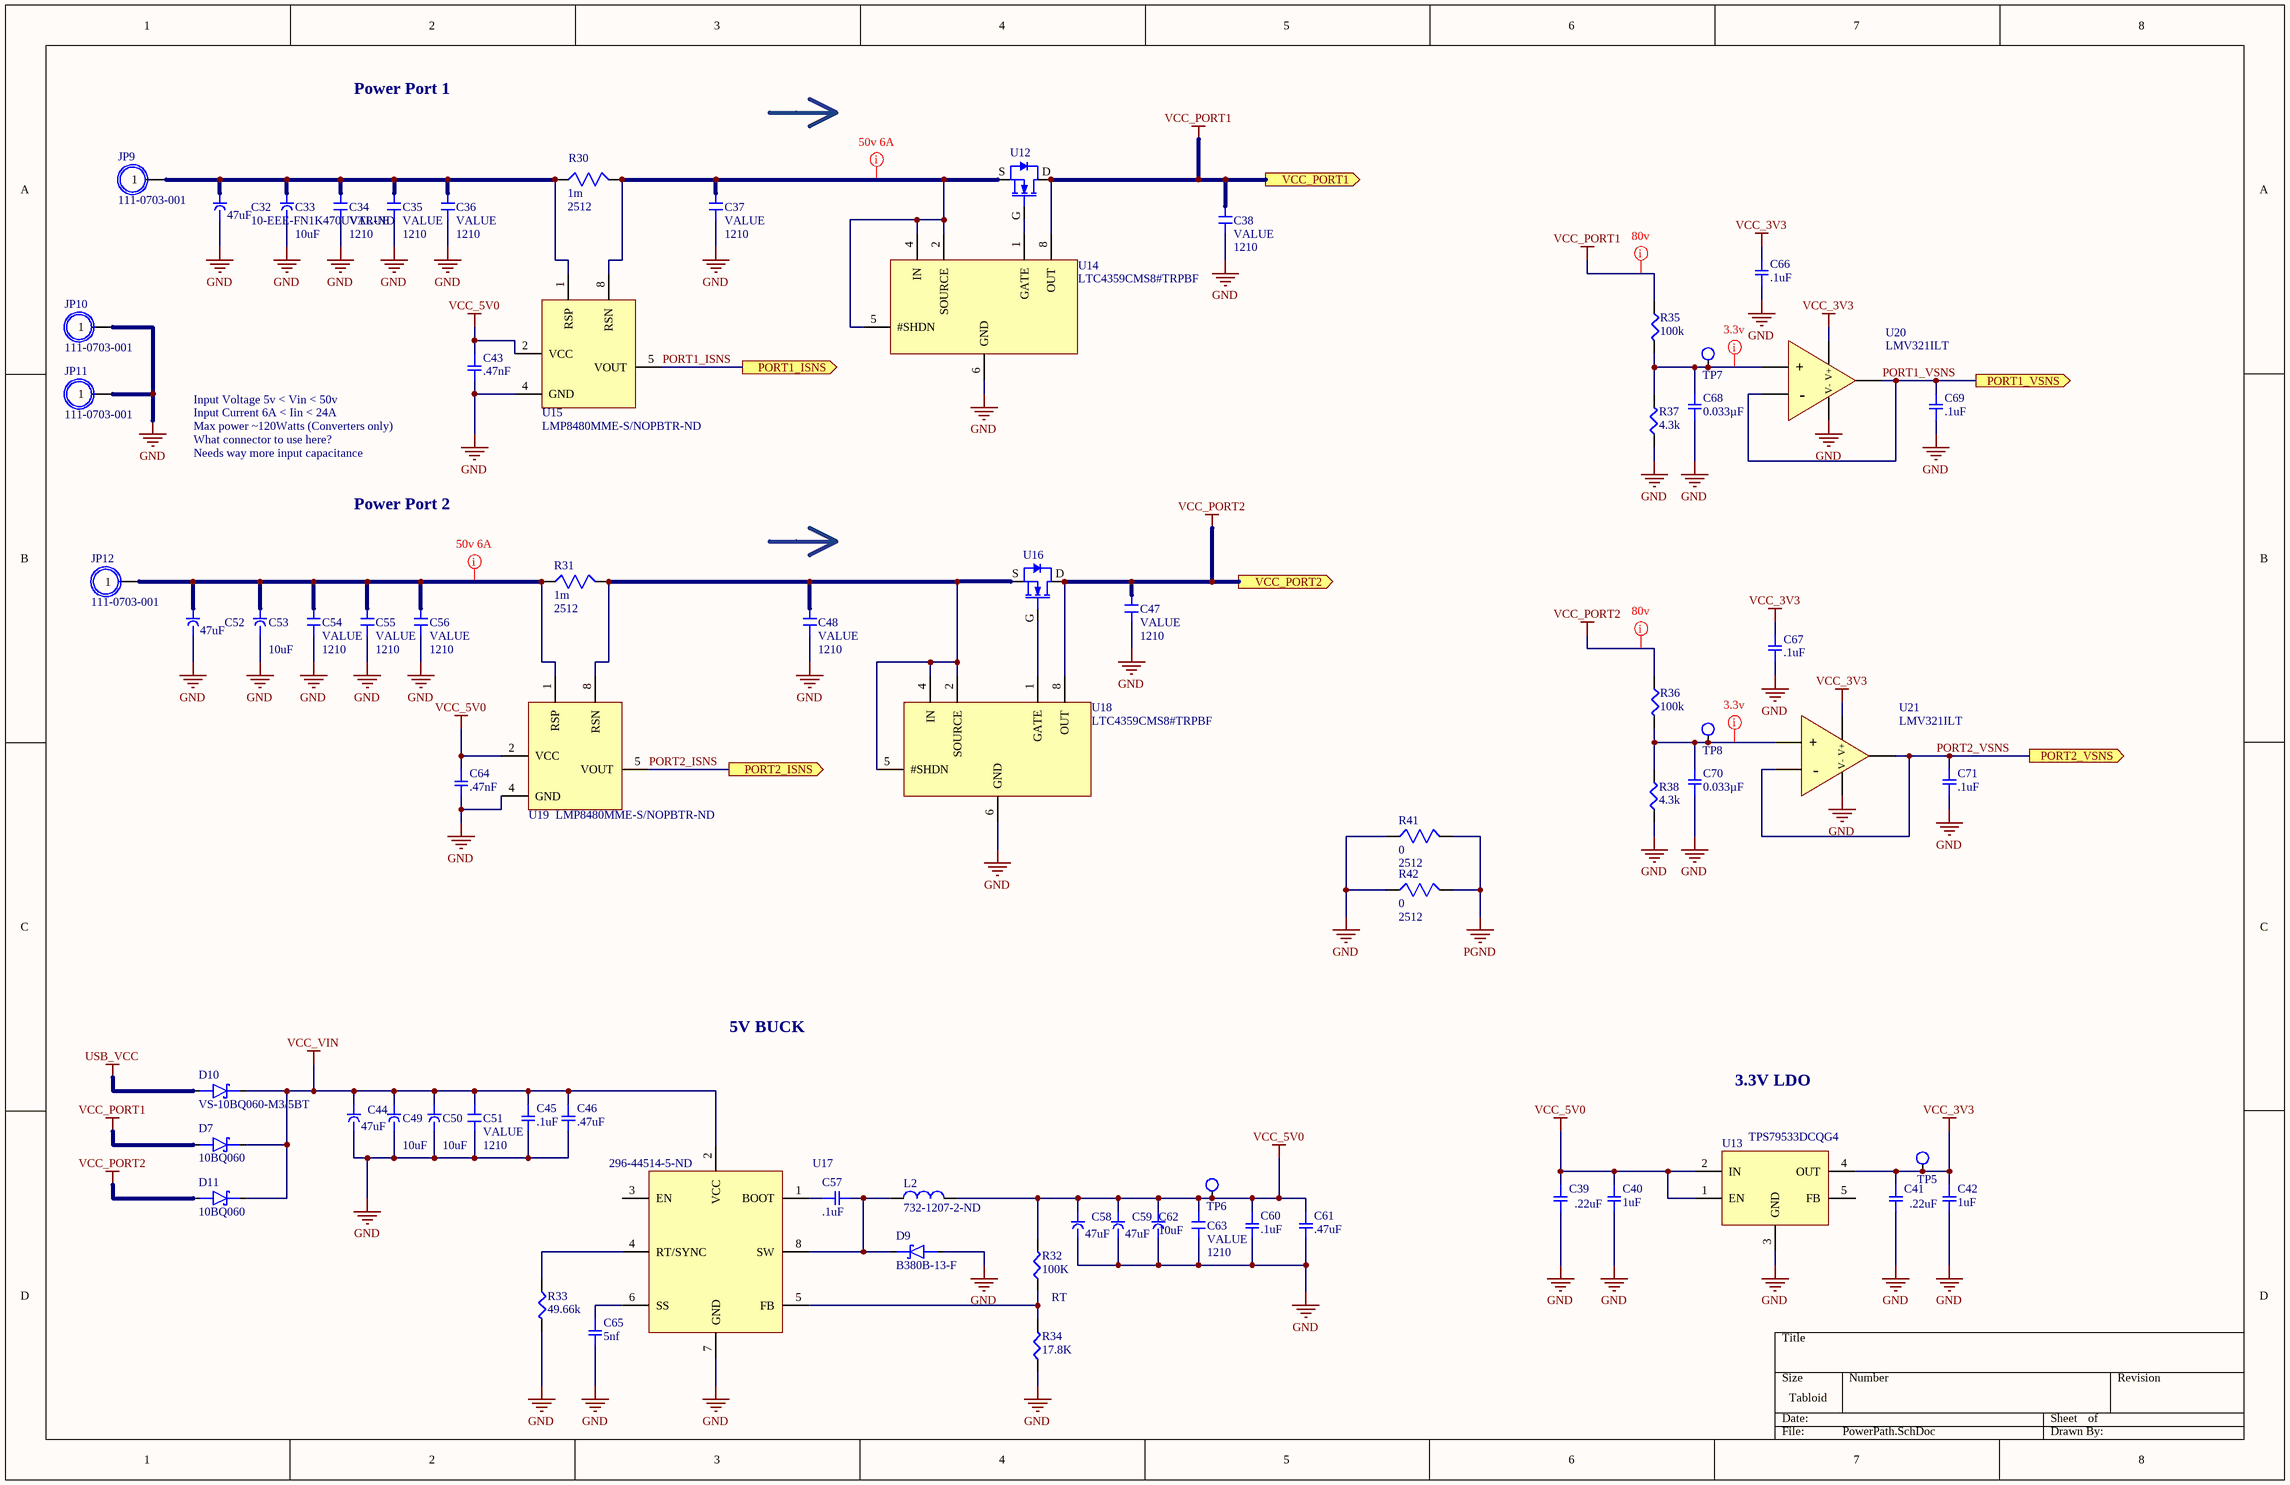
[diagram p3: PowerPath.SchDoc]

### Parts
C32  10-EEE-FN1K470UVTR-ND  [EEE-FN1K470UV]
C33  value 10uF  [panasonic d8]  (hidden comment: EEE-FN1K100XL)
C34  VALUE  Size: 1210  [1210 cap]
C35  VALUE  Size: 1210  [1210 cap]
C36  VALUE  Size: 1210  [1210 cap]
C37  VALUE  Size: 1210  [1210 cap]
C38  VALUE  Size: 1210  [1210 cap]
C39  .22uF  [SMD-0603C]
C40  1uF  [SMD-0603C]
C41  .22uF  [SMD-0603C]
C42  1uF  [SMD-0603C]
C43  .47nF  [SMD-0603C]
C44  10-EEE-FN1K470UVTR-ND  [EEE-FN1K470UV]  (value not drawn)
C45  .1uF  [SMD-0805C]
C46  .47uF  [SMD-0805C]
C47  VALUE  Size: 1210  [1210 cap]
C48  VALUE  Size: 1210  [1210 cap]
C49  value 10uF  [panasonic d8]  (hidden comment: EEE-FN1K100XL)
C50  value 10uF  [panasonic d8]  (hidden comment: EEE-FN1K100XL)
C51  VALUE  Size: 1210  [1210 cap]
C52  10-EEE-FN1K470UVTR-ND  [EEE-FN1K470UV]  (value not drawn)
C53  value 10uF  [panasonic d8]  (hidden comment: EEE-FN1K100XL)
C54  VALUE  Size: 1210  [1210 cap]
C55  VALUE  Size: 1210  [1210 cap]
C56  VALUE  Size: 1210  [1210 cap]
C57  .1uF  [SMD-0805C]
C58  10-EEE-FN1K470UVTR-ND  [EEE-FN1K470UV]  (value not drawn)
C59  10-EEE-FN1K470UVTR-ND  [EEE-FN1K470UV]  (value not drawn)
C60  .1uF  [SMD-0805C]
C61  .47uF  [SMD-0805C]
C62  value 10uF  [panasonic d8]  (hidden comment: EEE-FN1K100XL)
C63  VALUE  Size: 1210  [1210 cap]
C64  .47nF  [SMD-0603C]
C65  5nf  [SMD-0603C]
C66  .1uF  [SMD-0603C]
C67  .1uF  [SMD-0603C]
C68  0.033µF  [SMD-0603C]
C69  .1uF  [SMD-0603C]
C70  0.033µF  [SMD-0603C]
C71  .1uF  [SMD-0603C]
D7  10BQ060  [DO-214AA/SMB]
D9  B380B-13-F  [DO-214AA/SMB]
D10  VS-10BQ060-M3/5BT  [DO-214AA/SMB]
D11  10BQ060  [DO-214AA/SMB]
JP9  111-0703-001  [Banana Jack Post]
JP10  111-0703-001  [Banana Jack Post]
JP11  111-0703-001  [Banana Jack Post]
JP12  111-0703-001  [Banana Jack Post]
L2  732-1207-2-ND  [8R2]
R30  1m  [2512]
R31  1m  [2512]
R32  100K  [SMD-0603-RES]
R33  49.66k  [SMD-0603-RES]
R34  17.8K  [SMD-0603-RES]
R35  100k  [SMD-0805-RES]
R36  100k  [SMD-0805-RES]
R37  4.3k  [SMD-0603-RES]
R38  4.3k  [SMD-0603-RES]
R41  0  [2512]
R42  0  [2512]
TP5  TEST POINT 1MM  [TEST POINT]  (value not drawn)
TP6  TEST POINT 1MM  [TEST POINT]  (value not drawn)
TP7  TEST POINT 1MM  [TEST POINT]  (value not drawn)
TP8  TEST POINT 1MM  [TEST POINT]  (value not drawn)
U12  SQJA80EP-T1_GE3TR-ND  [PowerPAK® SO-8L SINGLE]  (value not drawn)
U13  TPS79533DCQG4  [6 pin sot223]
U14  LTC4359CMS8#TRPBF  [8-MSOP]
U15  LMP8480MME-S/NOPBTR-ND  [DGK(S-PDSO-G8)]
U16  SQJA80EP-T1_GE3TR-ND  [PowerPAK® SO-8L SINGLE]  (value not drawn)
U17  296-44514-5-ND  [DDA R-PDSO-G8]
U18  LTC4359CMS8#TRPBF  [8-MSOP]
U19  LMP8480MME-S/NOPBTR-ND  [DGK(S-PDSO-G8)]
U20  LMV321ILT  [SOT-23-5]
U21  LMV321ILT  [SOT-23-5]

### Ports
PORT1_ISNS (out), PORT1_VSNS (out), PORT2_ISNS (out), PORT2_VSNS (out), VCC_PORT1 (out), VCC_PORT2 (out)

### Nets
GND: C32.1 C33.2 C34.2 C35.2 C36.2 C37.2 C38.2 C39.2 C40.2 C41.2 C42.2 C43.2 C44.1 C45.2 C46.2 C47.2 C48.2 C49.2 C50.2 C51.2 C52.1 C53.2 C54.2 C55.2 C56.2 C58.1 C59.1 C60.2 C61.2 C62.2 C63.2 C64.2 C65.2 C66.1 C67.1 C68.1 C69.1 C70.1 C71.1 D9.2 JP10.1 JP11.1 R33.2 R34.1 R37.1 R38.1 R41.1 R42.1 U13.3(GND) U14.6(GND) U15.4(GND) U17.7(GND) U18.6(GND) U19.4(GND) U20.2(V-) U21.2(V-)
PGND: R41.2 R42.2
USB_VCC: D10.2
VCC_3V3: C41.1 C42.1 C66.2 C67.2 TP5.1 U13.4(OUT) U20.5(V+) U21.5(V+)
VCC_5V0: C39.1 C40.1 C43.1 C58.2 C59.2 C60.1 C61.1 C62.1 C63.1 C64.1 L2.2 R32.2 TP6.1 U13.1(EN) U13.2(IN) U15.2(VCC) U19.2(VCC)
VCC_PORT1: C38.1 D7.2 R35.1 U12.D(DRAIN) U14.8(OUT) ; port VCC_PORT1
VCC_PORT2: C47.1 D11.2 R36.1 U16.D(DRAIN) U18.8(OUT) ; port VCC_PORT2
VCC_VIN: C44.2 C45.1 C46.1 C49.1 C50.1 C51.1 D7.1 D10.1 D11.1 U17.2(VCC)
PORT1_ISNS: U15.5(VOUT) ; port PORT1_ISNS
PORT1_VSNS: C69.2 U20.3(-) U20.4(OUT) ; port PORT1_VSNS
PORT2_ISNS: U19.5(VOUT) ; port PORT2_ISNS
PORT2_VSNS: C71.2 U21.3(-) U21.4(OUT) ; port PORT2_VSNS
NetC32_2: C32.2 C33.1 C34.1 C35.1 C36.1 JP9.1 R30.1 U15.1(RSP)
NetC37_1: C37.1 R30.2 U12.S(SOURCE) U14.2(SOURCE) U14.4(IN) U14.5(#SHDN) U15.8(RSN)
NetC48_1: C48.1 R31.2 U16.S(SOURCE) U18.2(SOURCE) U18.4(IN) U18.5(#SHDN) U19.8(RSN)
NetC52_2: C52.2 C53.1 C54.1 C55.1 C56.1 JP12.1 R31.1 U19.1(RSP)
NetC57_1: C57.1 U17.1(BOOT)
NetC57_2: C57.2 D9.1 L2.1 U17.8(SW)
NetC65_1: C65.1 U17.6(SS)
NetC68_2: C68.2 R35.2 R37.2 TP7.1 U20.1(+)
NetC70_2: C70.2 R36.2 R38.2 TP8.1 U21.1(+)
NetR32_1: R32.1 R34.2 U17.5(FB)
NetR33_1: R33.1 U17.4(RT/SYNC)
NetU12_G: U12.G(GATE) U14.1(GATE)
NetU16_G: U16.G(GATE) U18.1(GATE)

Not connected (* = marked no-connect by the designer): U13 5(FB); U17 3(EN)

### Layout directives
mark named 50v 6A: NetC37_1, NetC52_2
mark named 80v: VCC_PORT1, VCC_PORT2
mark named 3.3v: NetC68_2, NetC70_2

### Notes on the sheet
- Power Port 1
- Input Voltage 5v < Vin < 50v
- Input Current 6A < Iin < 24A
- Max power ~120Watts (Converters only)
- What connector to use here?
- Needs way more input capacitance
- Power Port 2
- 5V BUCK
- 3.3V LDO
- RT
- (in symbol CAP ALUM 47UF) 47uF

### Library data of the parts
C32 C44 C52 C58 C59 = CAP ALUM 47UF: CAP ALUM 47UF 20% 80V SMD
C33 C49 C50 C53 C62 = CAP ALUM 10UF: CAP ALUM 10UF 20% 80V SMD
C34-C38 C47 C48 C51 C54-C56 C63 = CAP SMD 1210
C39-C42 = GCJ188R71E224KA12D: CAP CER 0.22UF 25V X7R 0603; Manufacturer: Murata Electronics North America; Factory Stock: 0; Unit Price (USD): 0.24; Minimum Quantity: 1; Value: 0.22µF; Tolerance: ±10%; Datasheets: http://www.murata.com/~/media/webrenewal/support/library/catalog/products/capacitor/mlcc/c03e.ashx; Image: //media.digikey.com/Renders/Murata%20Renders/0603%28LQG18%29.jpg; Digi-Key Part Number: 490-5797-1-ND; Part Number: GCJ188R71E224KA12D; Quantity Available: 23903; @ qty: 0; Packaging: Cut Tape (CT); Series: GCJ; Part Status: Active; Voltage: 25V; Temperature Coefficient: X7R; Operating Temperature: -55°C ~ 125°C; Features: Soft Termination; Ratings: AEC-Q200; Applications: Automotive, Boardflex Sensitive; Mounting Type: Surface Mount, MLCC; Package / Case: 0603 (1608 Metric); Size / Dimension: 0.063" L x 0.031" W (1.60mm x 0.80mm); Height - Seated (Max): -; Thickness (Max): 0.035" (0.90mm); Lead Spacing: -; Lead Style: -
C43 C64 = GCJ188R71H222KA01D: CAP CER 2200PF 50V X7R 0603; Manufacturer: Murata Electronics North America; Factory Stock: 0; Unit Price (USD): 0.16; Minimum Quantity: 1; Tolerance: ±10%; Datasheets: http://www.murata.com/~/media/webrenewal/support/library/catalog/products/capacitor/mlcc/c03e.ashx; Image: //media.digikey.com/Renders/Murata%20Renders/0603%28LQG18%29.jpg; Digi-Key Part Number: 490-5766-1-ND; Part Number: GCJ188R71H222KA01D; Quantity Available: 34786; @ qty: 0; Packaging: Cut Tape (CT); Series: GCJ; Part Status: Active; Value: 2200pF; Voltage: 50V; Temperature Coefficient: X7R; Operating Temperature: -55°C ~ 125°C; Features: Soft Termination; Ratings: AEC-Q200; Applications: Automotive, Boardflex Sensitive; Mounting Type: Surface Mount, MLCC; Package / Case: 0603 (1608 Metric); Size / Dimension: 0.063" L x 0.031" W (1.60mm x 0.80mm); Height - Seated (Max): -; Thickness (Max): 0.031" (0.80mm); Lead Spacing: -; Lead Style: -
C45 C46 C60 C61 = GRM2195C1H123FA01D: CAP CER 0.012UF 50V NP0 0805; Manufacturer: Murata Electronics North America; Factory Stock: 0; Unit Price (USD): 0.91; Minimum Quantity: 1; Value: 0.012µF; Tolerance: ±1%; Temperature Coefficient: C0G, NP0; Datasheets: http://www.murata.com/~/media/webrenewal/support/library/catalog/products/capacitor/mlcc/c02e.pdf; Image: //media.digikey.com/Renders/Murata%20Renders/0805%20(2012%20Metric)%20.85mm.jpg; Digi-Key Part Number: 490-12608-1-ND; Part Number: GRM2195C1H123FA01D; Quantity Available: 4905; @ qty: 0; Packaging: Cut Tape (CT); Series: GRM; Part Status: Active; Voltage: 50V; Operating Temperature: -55°C ~ 125°C; Features: -; Ratings: -; Applications: General Purpose; Mounting Type: Surface Mount, MLCC; Package / Case: 0805 (2012 Metric); Size / Dimension: 0.079" L x 0.049" W (2.00mm x 1.25mm); Height - Seated (Max): -; Thickness (Max): 0.037" (0.95mm); Lead Spacing: -; Lead Style: -
C57 = GRM2195C1H153GA01D: CAP CER 0.015UF 50V NP0 0805; Manufacturer: Murata Electronics North America; Factory Stock: 0; Unit Price (USD): 0.72; Minimum Quantity: 1; Value: 0.015µF; Tolerance: ±2%; Temperature Coefficient: C0G, NP0; Datasheets: http://www.murata.com/~/media/webrenewal/support/library/catalog/products/capacitor/mlcc/c02e.pdf; Image: //media.digikey.com/Renders/Murata%20Renders/0805%20(2012%20Metric)%20.85mm.jpg; Digi-Key Part Number: 490-11581-1-ND; Part Number: GRM2195C1H153GA01D; Quantity Available: 3423; @ qty: 0; Packaging: Cut Tape (CT); Series: GRM; Part Status: Active; Voltage: 50V; Operating Temperature: -55°C ~ 125°C; Features: -; Ratings: -; Applications: General Purpose; Mounting Type: Surface Mount, MLCC; Package / Case: 0805 (2012 Metric); Size / Dimension: 0.079" L x 0.049" W (2.00mm x 1.25mm); Height - Seated (Max): -; Thickness (Max): 0.037" (0.95mm); Lead Spacing: -; Lead Style: -
C65 = GCJ188R72A103KA01D: CAP CER 10000PF 100V X7R 0603; Manufacturer: Murata Electronics North America; Factory Stock: 0; Unit Price (USD): 0.21; Minimum Quantity: 1; Tolerance: ±10%; Datasheets: http://www.murata.com/~/media/webrenewal/support/library/catalog/products/capacitor/mlcc/c03e.ashx; Image: //media.digikey.com/Renders/Murata%20Renders/0603%28LQG18%29.jpg; Digi-Key Part Number: 490-5771-1-ND; Part Number: GCJ188R72A103KA01D; Quantity Available: 130287; @ qty: 0; Packaging: Cut Tape (CT); Series: GCJ; Part Status: Active; Value: 10000pF; Voltage: 100V; Temperature Coefficient: X7R; Operating Temperature: -55°C ~ 125°C; Features: Soft Termination; Ratings: AEC-Q200; Applications: Automotive, Boardflex Sensitive; Mounting Type: Surface Mount, MLCC; Package / Case: 0603 (1608 Metric); Size / Dimension: 0.063" L x 0.031" W (1.60mm x 0.80mm); Height - Seated (Max): -; Thickness (Max): 0.031" (0.80mm); Lead Spacing: -; Lead Style: -
C66 C67 C69 C71 = GCJ188R71H333KA12D: CAP CER 0.033UF 50V X7R 0603; Manufacturer: Murata Electronics North America; Factory Stock: 0; Unit Price (USD): 0.23; Minimum Quantity: 1; Value: 0.033µF; Tolerance: ±10%; Datasheets: http://www.murata.com/~/media/webrenewal/support/library/catalog/products/capacitor/mlcc/c03e.ashx; Image: //media.digikey.com/Renders/Murata%20Renders/0603%28LQG18%29.jpg; Digi-Key Part Number: 490-5852-1-ND; Part Number: GCJ188R71H333KA12D; Quantity Available: 16459; @ qty: 0; Packaging: Cut Tape (CT); Series: GCJ; Part Status: Active; Voltage: 50V; Temperature Coefficient: X7R; Operating Temperature: -55°C ~ 125°C; Features: Soft Termination; Ratings: AEC-Q200; Applications: Automotive, Boardflex Sensitive; Mounting Type: Surface Mount, MLCC; Package / Case: 0603 (1608 Metric); Size / Dimension: 0.063" L x 0.031" W (1.60mm x 0.80mm); Height - Seated (Max): -; Thickness (Max): 0.031" (0.80mm); Lead Spacing: -; Lead Style: -
C68 C70 = GCJ188R71H333KA12D: CAP CER 0.033UF 50V X7R 0603; Manufacturer: Murata Electronics North America; Factory Stock: 0; Unit Price (USD): 0.23; Minimum Quantity: 1; Tolerance: ±10%; Datasheets: http://www.murata.com/~/media/webrenewal/support/library/catalog/products/capacitor/mlcc/c03e.ashx; Image: //media.digikey.com/Renders/Murata%20Renders/0603%28LQG18%29.jpg; Digi-Key Part Number: 490-5852-1-ND; Part Number: GCJ188R71H333KA12D; Quantity Available: 16459; @ qty: 0; Packaging: Cut Tape (CT); Series: GCJ; Part Status: Active; Value: 0.033µF; Voltage: 50V; Temperature Coefficient: X7R; Operating Temperature: -55°C ~ 125°C; Features: Soft Termination; Ratings: AEC-Q200; Applications: Automotive, Boardflex Sensitive; Mounting Type: Surface Mount, MLCC; Package / Case: 0603 (1608 Metric); Size / Dimension: 0.063" L x 0.031" W (1.60mm x 0.80mm); Height - Seated (Max): -; Thickness (Max): 0.031" (0.80mm); Lead Spacing: -; Lead Style: -
D7 D11 = DIODE 10BQ060: DIODE SCHOTTKY 60V 1A SMB / Diode Schottky 60 V 1A Surface Mount DO-214AA (SMB) / https://assets.nexperia.com/documents/package-information/SOT669.pdf
D9 = DIODE B380B-13-F: DIODE SCHOTTKY 80V 3A SMB
D10 = DIODE 10BQ060: DIODE SCHOTTKY 60V 1A SMB
JP9-JP12 = CONN BANANA JACK: CONN BIND POST KNURLED BLACK‎
L2 = INDUCTOR 744771008: FIXED IND 8.2UH 6.25A 20MOHM SMD
R30 R31 R41 R42 = RES SMD 2512: RES SMD 2512 2W; Size: 2512
R32-R34 = ERJ-3BQFR22V: RES SMD 0.22 OHM 1% 1/4W 0603; Manufacturer: Panasonic Electronic Components; Factory Stock: 0; Unit Price (USD): 0.05386; @ qty: 1500; Minimum Quantity: 1; Value: 0.22; Power (Watts): 0.25W, 1/4W; Temperature Coefficient: ±300ppm/°C; Part Number: ERJ-3BQFR22V; Datasheets: https://industrial.panasonic.com/cdbs/www-data/pdf/RDA0000/AOA0000C239.pdf; Image: //media.digikey.com/Photos/Panasonic%20Photos/MFG_ERJ-P6W%20Series.jpg; Digi-Key Part Number: P17245CT-ND; Quantity Available: 11618; Packaging: Cut Tape (CT); Series: ERJ; Part Status: Active; Tolerance: ±1%; Composition: Thick Film; Features: Automotive AEC-Q200, Current Sense; Operating Temperature: -55°C ~ 125°C; Package / Case: 0603 (1608 Metric); Supplier Device Package: 0603; Size / Dimension: 0.063" L x 0.031" W (1.60mm x 0.80mm); Height - Seated (Max): 0.022" (0.55mm); Number of Terminations: 2; Failure Rate: -
R35 R36 = ERJ-6CWFR011V: RES SMD 0.011 OHM 1% 1/2W 0805; Manufacturer: Panasonic Electronic Components; Factory Stock: 0; Unit Price (USD): 0.17178; @ qty: 1500; Minimum Quantity: 1; Value: 0.011; Power (Watts): 0.5W, 1/2W; Temperature Coefficient: ±75ppm/°C; Part Number: ERJ-6CWFR011V; Datasheets: https://industrial.panasonic.com/cdbs/www-data/pdf/RDA0000/AOA0000C239.pdf; Image: //media.digikey.com/Renders/Panasonic%20Renders/ERJ-0805%20Pkg.jpg; Digi-Key Part Number: P19197CT-ND; Quantity Available: 4985; Packaging: Cut Tape (CT); Series: ERJ; Part Status: Active; Tolerance: ±1%; Composition: Thick Film; Features: Automotive AEC-Q200, Current Sense; Operating Temperature: -55°C ~ 125°C; Package / Case: 0805 (2012 Metric); Supplier Device Package: 0805; Size / Dimension: 0.081" L x 0.051" W (2.05mm x 1.30mm); Height - Seated (Max): 0.030" (0.75mm); Number of Terminations: 2; Failure Rate: -
R37 R38 = ERJ-3BQF2R0V: RES SMD 2 OHM 1% 1/4W 0603; Manufacturer: Panasonic Electronic Components; Factory Stock: 0; Unit Price (USD): 0.05386; @ qty: 1500; Minimum Quantity: 1; Value: 2; Power (Watts): 0.25W, 1/4W; Temperature Coefficient: ±200ppm/°C; Part Number: ERJ-3BQF2R0V; Datasheets: https://industrial.panasonic.com/cdbs/www-data/pdf/RDA0000/AOA0000C239.pdf; Image: //media.digikey.com/Photos/Panasonic%20Photos/MFG_ERJ-P6W%20Series.jpg; Digi-Key Part Number: P17377CT-ND; Quantity Available: 221; Packaging: Cut Tape (CT); Series: ERJ; Part Status: Active; Tolerance: ±1%; Composition: Thick Film; Features: Automotive AEC-Q200, Current Sense; Operating Temperature: -55°C ~ 125°C; Package / Case: 0603 (1608 Metric); Supplier Device Package: 0603; Size / Dimension: 0.063" L x 0.031" W (1.60mm x 0.80mm); Height - Seated (Max): 0.022" (0.55mm); Number of Terminations: 2; Failure Rate: -
TP5-TP8 = TEST POINT 1MM: 1mm pad for test points
U12 U16 = FET SQJA80EP-T1_GE3: MOSFET N-CH 80V 60A PPAK SO-8
U13 = IC REG TPS79533DCQG4: IC REG LIN 3.3V 500MA SOT223-6
U14 U18 = IC LTC4359: OR Controller N+1 ORing Controller N-Channel N:1 8-MSOP
U15 U19 = IC LMP8480: IC CURR SENSE 1 CIRCUIT 8VSSOP
U17 = IC LMR16030SDDA: IC REG BUCK ADJUSTABLE 3A 8SOPWR
U20 U21 = IC OPAMP GP 1 CIRCUIT: IC OPAMP GP 1 CIRCUIT SOT23-5

## Sheet CPU.SchDoc
size Tabloid
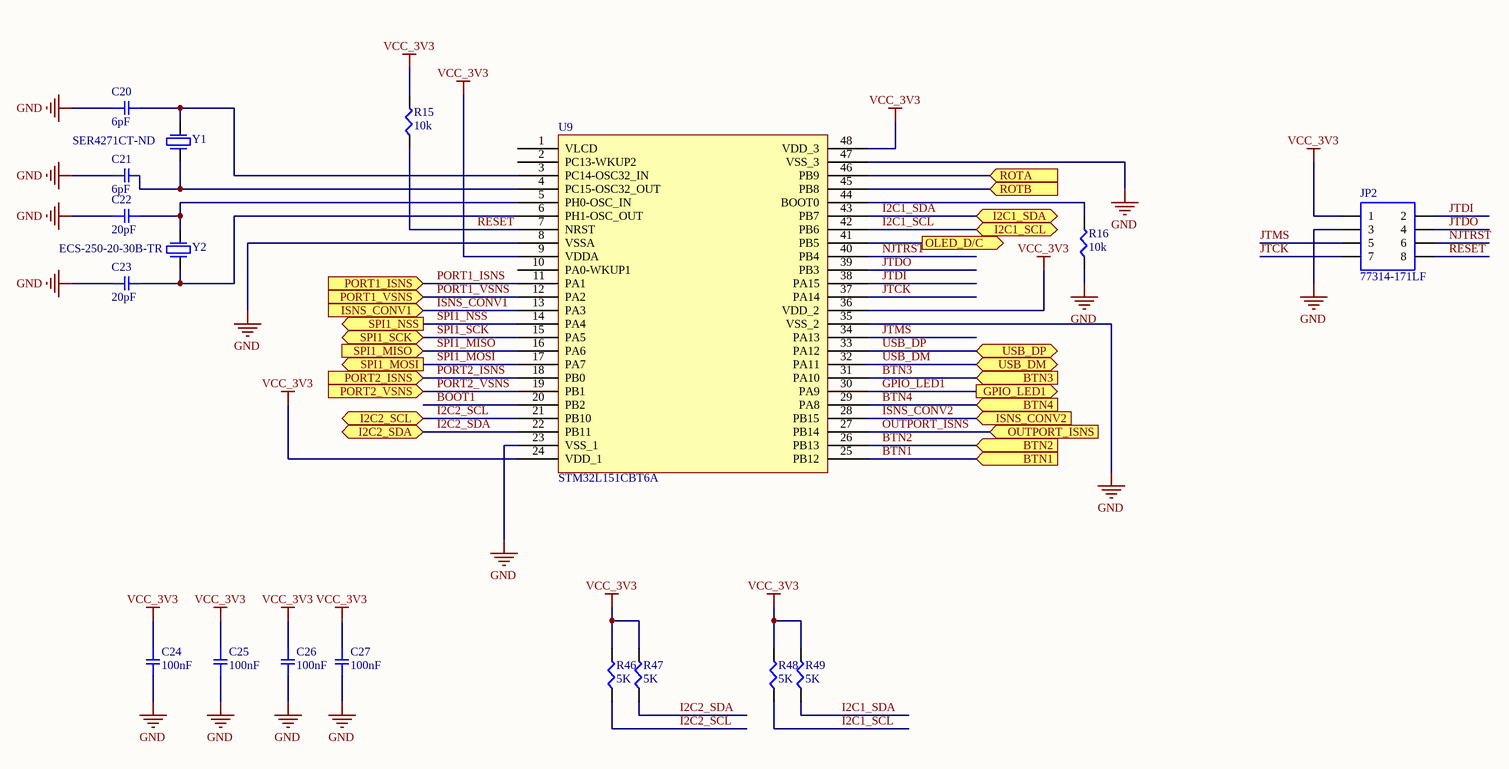
[diagram p4: CPU.SchDoc]

### Parts
C20  6pF  [SMD-0805C]
C21  6pF  [SMD-0805C]
C22  20pF  [SMD-0805C]
C23  20pF  [SMD-0805C]
C24  100nF  [SMD-0805C]
C25  100nF  [SMD-0805C]
C26  100nF  [SMD-0805C]
C27  100nF  [SMD-0805C]
JP2  77314-171LF  [2x4 Pin Header]
R15  10k  [SMD-0603-RES]
R16  10k  [SMD-0603-RES]
R46  5K  [SMD-0603-RES]
R47  5K  [SMD-0603-RES]
R48  5K  [SMD-0603-RES]
R49  5K  [SMD-0603-RES]
U9  STM32L151CBT6A  [LQFP_151CBT6A_STM]
Y1  SER4271CT-ND  [ABS07-120]
Y2  ECS-250-20-30B-TR  [4-SMD XTAL]

### Ports
BTN1 (in), BTN2 (in), BTN3 (in), BTN4 (in), GPIO_LED1 (out), I2C1_SCL (bidir), I2C1_SDA (bidir), I2C2_SCL (bidir), I2C2_SDA (bidir), ISNS_CONV1 (in), ISNS_CONV2 (in), OLED_D/C (out), OUTPORT_ISNS (in), PORT1_ISNS (in), PORT1_VSNS (in), PORT2_ISNS (in), PORT2_VSNS (in), ROTA (in), ROTB (in), SPI1_MISO (in), SPI1_MOSI (out), SPI1_NSS (out), SPI1_SCK (bidir), USB_DM (bidir), USB_DP (bidir)

### Nets
GND: C20.1 C21.1 C22.1 C23.1 C24.2 C25.2 C26.2 C27.2 JP2.3 R16.1 U9.8(VSSA) U9.23(VSS_1) U9.35(VSS_2) U9.47(VSS_3)
VCC_3V3: C24.1 C25.1 C26.1 C27.1 JP2.1 R15.2 R46.2 R47.2 R48.2 R49.2 U9.9(VDDA) U9.24(VDD_1) U9.36(VDD_2) U9.48(VDD_3)
BOOT1: U9.20(PB2)
BTN1: U9.25(PB12) ; port BTN1
BTN2: U9.26(PB13) ; port BTN2
BTN3: U9.31(PA10) ; port BTN3
BTN4: U9.29(PA8) ; port BTN4
GPIO_LED1: U9.30(PA9) ; port GPIO_LED1
I2C1_SCL: R48.1 U9.42(PB6) ; port I2C1_SCL
I2C1_SDA: R49.1 U9.43(PB7) ; port I2C1_SDA
I2C2_SCL: R46.1 U9.21(PB10) ; port I2C2_SCL
I2C2_SDA: R47.1 U9.22(PB11) ; port I2C2_SDA
ISNS_CONV1: U9.13(PA3) ; port ISNS_CONV1
ISNS_CONV2: U9.28(PB15) ; port ISNS_CONV2
JTCK: JP2.7 U9.37(PA14)
JTDI: JP2.2 U9.38(PA15)
JTDO: JP2.4 U9.39(PB3)
JTMS: JP2.5 U9.34(PA13)
NJTRST: JP2.6 U9.40(PB4)
OUTPORT_ISNS: U9.27(PB14) ; port OUTPORT_ISNS
PORT1_ISNS: U9.11(PA1) ; port PORT1_ISNS
PORT1_VSNS: U9.12(PA2) ; port PORT1_VSNS
PORT2_ISNS: U9.18(PB0) ; port PORT2_ISNS
PORT2_VSNS: U9.19(PB1) ; port PORT2_VSNS
RESET: JP2.8 R15.1 U9.7(NRST)
SPI1_MISO: U9.16(PA6) ; port SPI1_MISO
SPI1_MOSI: U9.17(PA7) ; port SPI1_MOSI
SPI1_NSS: U9.14(PA4) ; port SPI1_NSS
SPI1_SCK: U9.15(PA5) ; port SPI1_SCK
USB_DM: U9.32(PA11) ; port USB_DM
USB_DP: U9.33(PA12) ; port USB_DP
NetC20_2: C20.2 U9.3(PC14-OSC32_IN) Y1.1
NetC21_2: C21.2 U9.4(PC15-OSC32_OUT) Y1.2
NetC22_2: C22.2 U9.5(PH0-OSC_IN) Y2.1
NetC23_2: C23.2 U9.6(PH1-OSC_OUT) Y2.3
NetR16_2: R16.2 U9.44(BOOT0)
NetR40_1: U9.46(PB9) ; port ROTA
NetR43_1: U9.45(PB8) ; port ROTB
NetU9_41: U9.41(PB5) ; port OLED_D/C

Not connected (* = marked no-connect by the designer): U9 1(VLCD) 2(PC13-WKUP2) 10(PA0-WKUP1)

### Library data of the parts
C20-C27 = GCM21BR71H104KA37L: CAP CER 0.1UF 50V X7R 0805; Manufacturer: Murata Electronics North America; Factory Stock: 0; Unit Price (USD): 0.12; Minimum Quantity: 1; Value: 0.10µF; Tolerance: ±10%; Datasheets: http://www.murata.com/~/media/webrenewal/support/library/catalog/products/capacitor/mlcc/c03e.ashx; Image: //media.digikey.com/photos/Murata%20Photos/NCP,GCM%20SERIES%200805.jpg; Digi-Key Part Number: 490-6064-1-ND; Part Number: GCM21BR71H104KA37L; Quantity Available: 76325; @ qty: 0; Packaging: Cut Tape (CT); Series: GCM; Part Status: Active; Voltage: 50V; Temperature Coefficient: X7R; Operating Temperature: -55°C ~ 125°C; Features: -; Ratings: AEC-Q200; Applications: Automotive; Mounting Type: Surface Mount, MLCC; Package / Case: 0805 (2012 Metric); Size / Dimension: 0.079" L x 0.049" W (2.00mm x 1.25mm); Height - Seated (Max): -; Thickness (Max): 0.055" (1.40mm); Lead Spacing: -; Lead Style: -
JP2 = CONN HEADER VERT 2x4: CONN HEADER VERT 8POS 2.54MM
R15 R16 = ERJ-3BQF1R6V: RES SMD 1.6 OHM 1% 1/4W 0603; Manufacturer: Panasonic Electronic Components; Factory Stock: 0; Unit Price (USD): 0.05386; @ qty: 1500; Minimum Quantity: 1; Value: 1.6; Power (Watts): 0.25W, 1/4W; Temperature Coefficient: ±200ppm/°C; Part Number: ERJ-3BQF1R6V; Datasheets: https://industrial.panasonic.com/cdbs/www-data/pdf/RDA0000/AOA0000C239.pdf; Image: //media.digikey.com/Photos/Panasonic%20Photos/MFG_ERJ-P6W%20Series.jpg; Digi-Key Part Number: P17375CT-ND; Quantity Available: 1850; Packaging: Cut Tape (CT); Series: ERJ; Part Status: Active; Tolerance: ±1%; Composition: Thick Film; Features: Automotive AEC-Q200, Current Sense; Operating Temperature: -55°C ~ 125°C; Package / Case: 0603 (1608 Metric); Supplier Device Package: 0603; Size / Dimension: 0.063" L x 0.031" W (1.60mm x 0.80mm); Height - Seated (Max): 0.022" (0.55mm); Number of Terminations: 2; Failure Rate: -
R46-R49 = ERJ-3BQF1R5V: as R27 on sheet Devices; Part Number: ERJ-3BQF1R5V; Datasheets: https://industrial.panasonic.com/cdbs/www-data/pdf/RDA0000/AOA0000C239.pdf; Image: //media.digikey.com/Photos/Panasonic%20Photos/MFG_ERJ-P6W%20Series.jpg; Digi-Key Part Number: P15988CT-ND; Quantity Available: 1591; Packaging: Cut Tape (CT); Series: ERJ; Part Status: Active; Tolerance: ±1%; Composition: Thick Film; Features: Automotive AEC-Q200, Current Sense; Operating Temperature: -55°C ~ 125°C; Package / Case: 0603 (1608 Metric); Supplier Device Package: 0603; Size / Dimension: 0.063" L x 0.031" W (1.60mm x 0.80mm); Height - Seated (Max): 0.022" (0.55mm); Number of Terminations: 2; Failure Rate: -
U9 = IC STM32L151CBT6A_1: No Description Available; Vendor: STMicroelectronics; Built_By: EMA_Matt; SourceLibrary: Add_to_database_2021-03-16; Datasheet: https://www.mouser.com/datasheet/2/389/dm00078689-1797705.pdf; Copyright: Copyright (C) 2018 Accelerated Designs. All rights reserved; Manufacturer_Part_Number: STM32L151CBT6A; RefDes: RefDes; Type: DEV
Y1 = CRYSTAL 32.7680KHZ: 32.768kHz ±20ppm Crystal 6pF 55 kOhms 2-SMD, No Lead
Y2 = CRYSTAL 20MHZ: CRYSTAL 20MHZ 18PF SMD

## Sheet PowerOut.SchDoc
size Tabloid
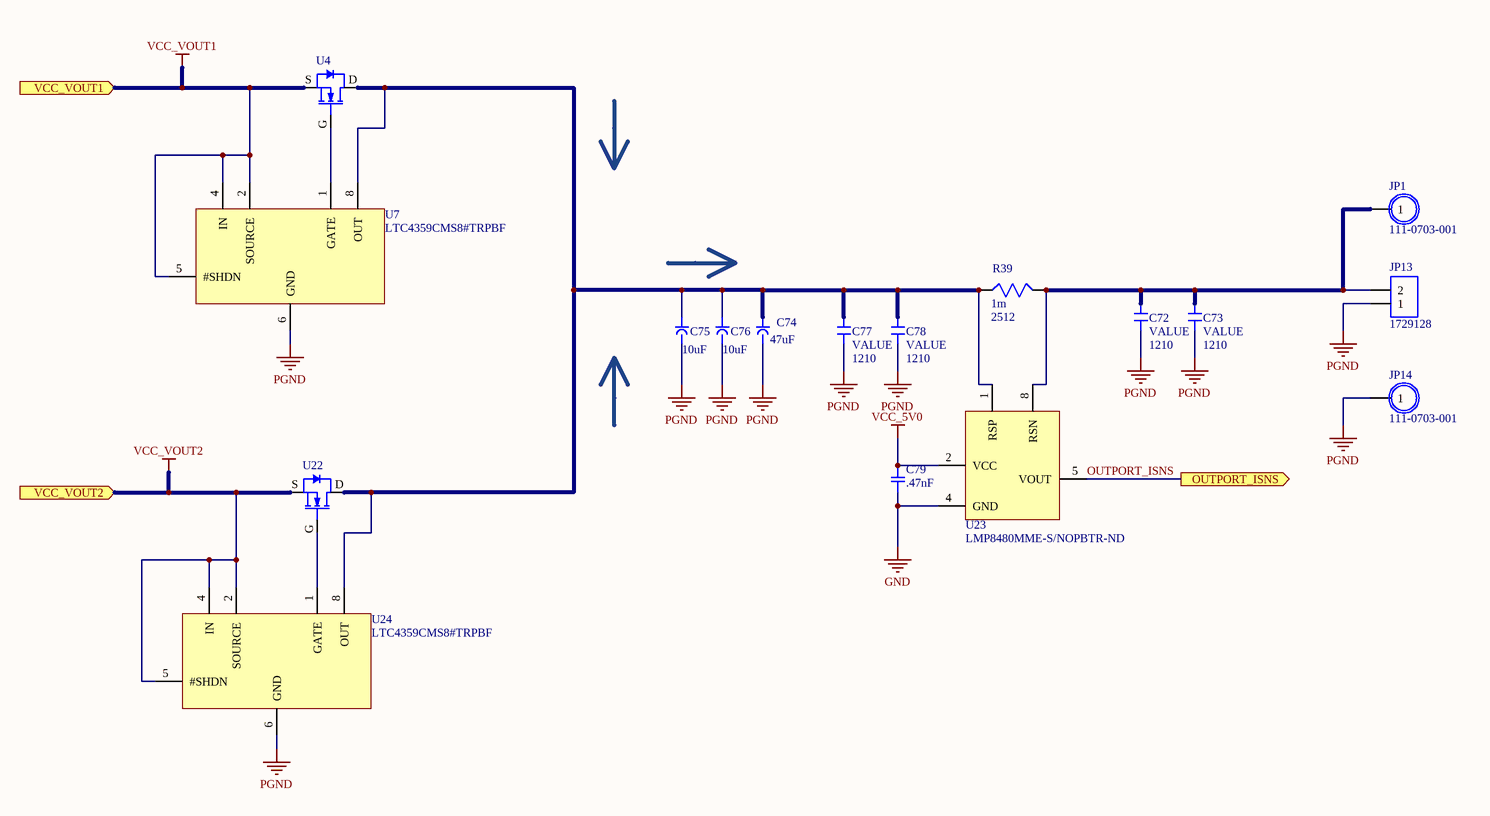
[diagram p5: PowerOut.SchDoc]

### Parts
C72  VALUE  Size: 1210  [1210 cap]
C73  VALUE  Size: 1210  [1210 cap]
C74  10-EEE-FN1K470UVTR-ND  [EEE-FN1K470UV]  (value not drawn)
C75  value 10uF  [panasonic d8]  (hidden comment: EEE-FN1K100XL)
C76  value 10uF  [panasonic d8]  (hidden comment: EEE-FN1K100XL)
C77  VALUE  Size: 1210  [1210 cap]
C78  VALUE  Size: 1210  [1210 cap]
C79  .47nF  [SMD-0603C]
JP1  111-0703-001  [Banana Jack Post]
JP13  1729128  [2x1_Term_Block]
JP14  111-0703-001  [Banana Jack Post]
R39  1m  [2512]
U4  (no value)  [PowerPAK® SO-8L SINGLE]
U7  LTC4359CMS8#TRPBF  [8-MSOP]
U22  (no value)  [PowerPAK® SO-8L SINGLE]
U23  LMP8480MME-S/NOPBTR-ND  [DGK(S-PDSO-G8)]
U24  LTC4359CMS8#TRPBF  [8-MSOP]

### Ports
OUTPORT_ISNS (out), VCC_VOUT1 (in), VCC_VOUT2 (in)

### Nets
GND: C79.2 U23.4(GND)
PGND: C72.2 C73.2 C74.1 C75.2 C76.2 C77.2 C78.2 JP13.1 JP14.1 U7.6(GND) U24.6(GND)
VCC_5V0: C79.1 U23.2(VCC)
VCC_VOUT1: U4.S(SOURCE) U7.2(SOURCE) U7.4(IN) U7.5(#SHDN) ; port VCC_VOUT1
VCC_VOUT2: U22.S(SOURCE) U24.2(SOURCE) U24.4(IN) U24.5(#SHDN) ; port VCC_VOUT2
OUTPORT_ISNS: U23.5(VOUT) ; port OUTPORT_ISNS
NetC72_1: C72.1 C73.1 JP1.1 JP13.2 R39.2 U23.8(RSN)
NetC74_2: C74.2 C75.1 C76.1 C77.1 C78.1 R39.1 U4.D(DRAIN) U7.8(OUT) U22.D(DRAIN) U23.1(RSP) U24.8(OUT)
NetU4_G: U4.G(GATE) U7.1(GATE)
NetU22_G: U22.G(GATE) U24.1(GATE)

### Notes on the sheet
- (in symbol CAP ALUM 47UF) 47uF

### Library data of the parts
C72 C73 C77 C78 = CAP SMD 1210
C74 = CAP ALUM 47UF: CAP ALUM 47UF 20% 80V SMD
C75 C76 = CAP ALUM 10UF: CAP ALUM 10UF 20% 80V SMD
C79 = GCJ188R71H222KA01D: as C43 on sheet PowerPath; Datasheets: http://www.murata.com/~/media/webrenewal/support/library/catalog/products/capacitor/mlcc/c03e.ashx; Image: //media.digikey.com/Renders/Murata%20Renders/0603%28LQG18%29.jpg; Digi-Key Part Number: 490-5766-1-ND; Part Number: GCJ188R71H222KA01D; Quantity Available: 34786; @ qty: 0; Packaging: Cut Tape (CT); Series: GCJ; Part Status: Active; Value: 2200pF; Voltage: 50V; Temperature Coefficient: X7R; Operating Temperature: -55°C ~ 125°C; Features: Soft Termination; Ratings: AEC-Q200; Applications: Automotive, Boardflex Sensitive; Mounting Type: Surface Mount, MLCC; Package / Case: 0603 (1608 Metric); Size / Dimension: 0.063" L x 0.031" W (1.60mm x 0.80mm); Height - Seated (Max): -; Thickness (Max): 0.031" (0.80mm); Lead Spacing: -; Lead Style: -
JP1 JP14 = CONN BANANA JACK: CONN BIND POST KNURLED BLACK‎
JP13 = TERM BLK 2P SIDE ENT 5.08MM: Phoenix Contact-1729128
R39 = RES SMD 2512: RES SMD 2512 2W; Size: 2512
U4 U22 = FET SQJA80EP-T1_GE3: MOSFET N-CH 80V 60A PPAK SO-8
U7 U24 = IC LTC4359: as U14 on sheet PowerPath
U23 = IC LMP8480: IC CURR SENSE 1 CIRCUIT 8VSSOP